# Altium project Humpback.PrjPCB (part 1 of 4)
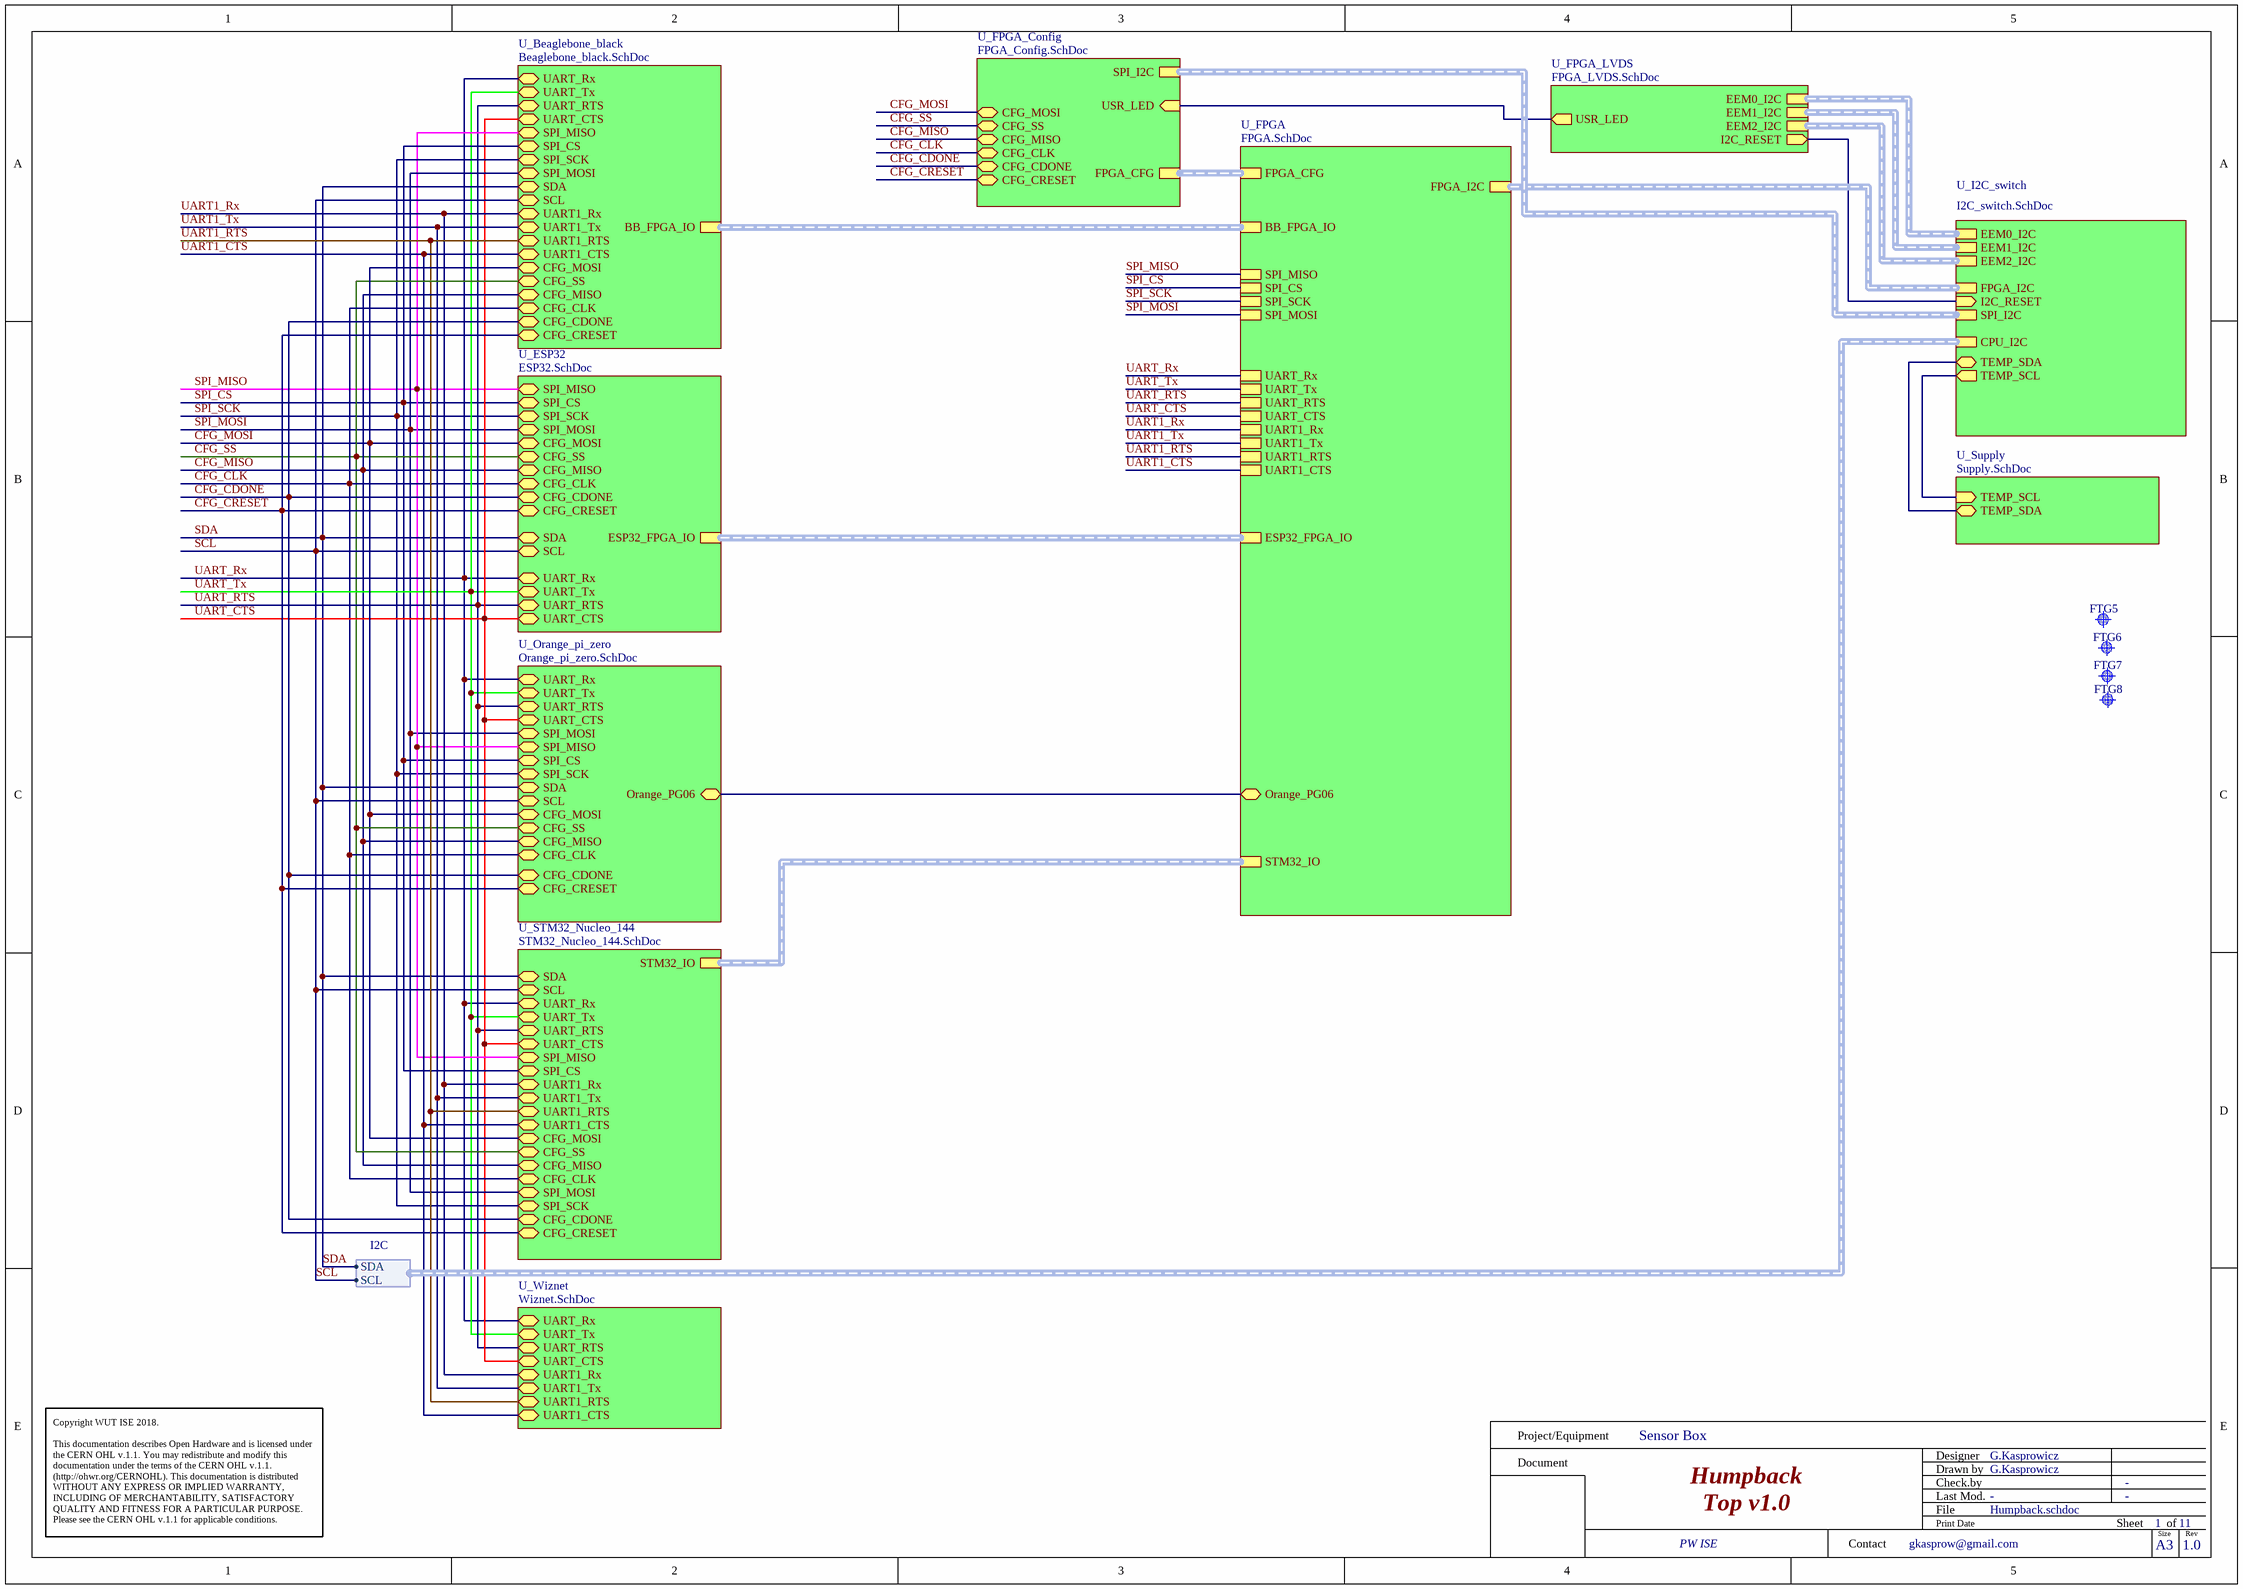
[diagram p0: Humpback.schdoc]
11 sheets, 333 parts. Net scope: hierarchical (ports join the sheet entries above them; power ports are global).
Board files: Humpback.PCBDOC, Panel_Humpback.PcbDoc
Sheets:
  Humpback.schdoc
    U_FPGA_LVDS = FPGA_LVDS.SchDoc
    U_FPGA = FPGA.SchDoc
    U_I2C_switch = I2C_switch.SchDoc
    U_Supply = Supply.SchDoc
    U_FPGA_Config = FPGA_Config.SchDoc
    U_ESP32 = ESP32.SchDoc
    U_Orange_pi_zero = Orange_pi_zero.SchDoc
    U_STM32_Nucleo_144 = STM32_Nucleo_144.SchDoc
    U_Wiznet = Wiznet.SchDoc
    U_Beaglebone_black = Beaglebone_black.SchDoc

## Sheet Humpback.schdoc: Humpback
size 420 x 297 mm; EDA_Number: ARTIQ; Projet: Humpback; Author: G.Kasprowicz; CompanyName: WUT ISE; DrawnBy: G.Kasprowicz; Organization: WUT ISE; Address1: PW ISE; Address2: Nowowiejska 15/19 00-665 Warsaw; Address3: gkasprow@gmail.com; DocumentNumber: 1; Revision: 1.0; SheetNumber: 1; SheetTotal: 11; ModifiedBy: -; CheckedDate: -; Title2: Top v1.0; DivGrp: WUT ISE; Designer: G.Kasprowicz; ModifiedDate: -; ProjectName: Sensor Box

### Parts
FTG5  Use only in PCB  [FIDUCIAL_TOP_C100-200]  (value not drawn)
FTG6  Use only in PCB  [FIDUCIAL_TOP_S100-200]  (value not drawn)
FTG7  Use only in PCB  [FIDUCIAL_TOP_S200-400]  (value not drawn)
FTG8  Use only in PCB  [FIDUCIAL_TOP_S100-200]  (value not drawn)

### Sub-sheets
U_Beaglebone_black = Beaglebone_black.SchDoc: UART_Rx (bidir), UART_Tx (bidir), UART_RTS (bidir), UART_CTS (bidir), SPI_MISO (bidir), SPI_CS (bidir), SPI_SCK (bidir), SCL (bidir), SDA (bidir), SPI_MOSI (bidir), UART1_Rx (bidir), UART1_Tx (bidir), UART1_RTS (bidir), UART1_CTS (bidir), CFG_MOSI (bidir), CFG_SS (bidir), CFG_MISO (bidir), CFG_CLK (bidir), CFG_CDONE (bidir), CFG_CRESET (bidir), BB_FPGA_IO (harness BB_FPGA_IO)
U_ESP32 = ESP32.SchDoc: SPI_MISO (bidir), SPI_CS (bidir), SPI_SCK (bidir), SPI_MOSI (bidir), CFG_MOSI (bidir), CFG_SS (bidir), CFG_MISO (bidir), CFG_CLK (bidir), UART_RTS (bidir), UART_Rx (bidir), UART_Tx (bidir), SDA (bidir), SCL (bidir), UART_CTS (bidir), CFG_CDONE (bidir), CFG_CRESET (bidir), ESP32_FPGA_IO (harness ESP32_FPGA_IO)
U_FPGA = FPGA.SchDoc: FPGA_I2C (harness I2C), FPGA_CFG (harness FPGA_CFG), BB_FPGA_IO (harness BB_FPGA_IO), SPI_MISO, SPI_CS, SPI_SCK, SPI_MOSI, UART_Rx, UART_Tx, UART_RTS, UART_CTS, UART1_Rx, UART1_Tx, UART1_RTS, UART1_CTS, ESP32_FPGA_IO (harness ESP32_FPGA_IO), Orange_PG06 (bidir), STM32_IO (harness STM32_IO)
U_FPGA_Config = FPGA_Config.SchDoc: FPGA_CFG (harness FPGA_CFG), SPI_I2C (harness I2C), USR_LED (in), CFG_CLK (bidir), CFG_MISO (bidir), CFG_SS (bidir), CFG_MOSI (bidir), CFG_CDONE (bidir), CFG_CRESET (bidir)
U_FPGA_LVDS = FPGA_LVDS.SchDoc: EEM0_I2C (harness I2C), EEM1_I2C (harness I2C), EEM2_I2C (harness I2C), USR_LED (out), I2C_RESET (out)
U_I2C_switch = I2C_switch.SchDoc: EEM0_I2C (harness I2C), EEM1_I2C (harness I2C), FPGA_I2C (harness I2C), SPI_I2C (harness I2C), I2C_RESET (in), TEMP_SCL (out), TEMP_SDA (bidir), EEM2_I2C (harness I2C), CPU_I2C (harness I2C)
U_Orange_pi_zero = Orange_pi_zero.SchDoc: UART_Rx (bidir), UART_Tx (bidir), UART_RTS (bidir), UART_CTS (bidir), SPI_MOSI (bidir), SPI_MISO (bidir), SPI_CS (bidir), SPI_SCK (bidir), SDA (bidir), SCL (bidir), CFG_MOSI (bidir), CFG_SS (bidir), CFG_MISO (bidir), CFG_CLK (bidir), CFG_CDONE (bidir), CFG_CRESET (bidir), Orange_PG06 (bidir)
U_STM32_Nucleo_144 = STM32_Nucleo_144.SchDoc: STM32_IO (harness STM32_IO), SDA (bidir), SCL (bidir), UART_Rx (bidir), UART_Tx (bidir), UART_RTS (bidir), UART_CTS (bidir), SPI_MISO (bidir), SPI_CS (bidir), UART1_Rx (bidir), UART1_Tx (bidir), UART1_RTS (bidir), UART1_CTS (bidir), CFG_MOSI (bidir), CFG_SS (bidir), CFG_MISO (bidir), CFG_CLK (bidir), SPI_MOSI (bidir), SPI_SCK (bidir), CFG_CDONE (bidir), CFG_CRESET (bidir)
U_Supply = Supply.SchDoc: TEMP_SCL (in), TEMP_SDA (bidir)
U_Wiznet = Wiznet.SchDoc: UART_Rx (bidir), UART_Tx (bidir), UART_RTS (bidir), UART_CTS (bidir), UART1_Rx (bidir), UART1_Tx (bidir), UART1_RTS (bidir), UART1_CTS (bidir)

### Harnesses
I2C: SDA, SCL

### Nets
CFG_CDONE: sheet U_FPGA_Config/CFG_CDONE, sheet U_ESP32/CFG_CDONE, sheet U_Orange_pi_zero/CFG_CDONE, sheet U_STM32_Nucleo_144/CFG_CDONE, sheet U_Beaglebone_black/CFG_CDONE
CFG_CLK: sheet U_FPGA_Config/CFG_CLK, sheet U_ESP32/CFG_CLK, sheet U_Orange_pi_zero/CFG_CLK, sheet U_STM32_Nucleo_144/CFG_CLK, sheet U_Beaglebone_black/CFG_CLK
CFG_CRESET: sheet U_FPGA_Config/CFG_CRESET, sheet U_ESP32/CFG_CRESET, sheet U_Orange_pi_zero/CFG_CRESET, sheet U_STM32_Nucleo_144/CFG_CRESET, sheet U_Beaglebone_black/CFG_CRESET
CFG_MISO: sheet U_FPGA_Config/CFG_MISO, sheet U_ESP32/CFG_MISO, sheet U_Orange_pi_zero/CFG_MISO, sheet U_STM32_Nucleo_144/CFG_MISO, sheet U_Beaglebone_black/CFG_MISO
CFG_MOSI: sheet U_FPGA_Config/CFG_MOSI, sheet U_ESP32/CFG_MOSI, sheet U_Orange_pi_zero/CFG_MOSI, sheet U_STM32_Nucleo_144/CFG_MOSI, sheet U_Beaglebone_black/CFG_MOSI
CFG_SS: sheet U_FPGA_Config/CFG_SS, sheet U_ESP32/CFG_SS, sheet U_Orange_pi_zero/CFG_SS, sheet U_STM32_Nucleo_144/CFG_SS, sheet U_Beaglebone_black/CFG_SS
I2C_RESET: sheet U_FPGA_LVDS/I2C_RESET, sheet U_I2C_switch/I2C_RESET
Orange_PG06: sheet U_FPGA/Orange_PG06, sheet U_Orange_pi_zero/Orange_PG06
SCL: sheet U_ESP32/SCL, sheet U_Orange_pi_zero/SCL, sheet U_STM32_Nucleo_144/SCL, sheet U_Beaglebone_black/SCL, sheet U_I2C_switch/CPU_I2C.SCL
SDA: sheet U_ESP32/SDA, sheet U_Orange_pi_zero/SDA, sheet U_STM32_Nucleo_144/SDA, sheet U_Beaglebone_black/SDA, sheet U_I2C_switch/CPU_I2C.SDA
SPI_CS: sheet U_FPGA/SPI_CS, sheet U_ESP32/SPI_CS, sheet U_Orange_pi_zero/SPI_CS, sheet U_STM32_Nucleo_144/SPI_CS, sheet U_Beaglebone_black/SPI_CS
SPI_MISO: sheet U_FPGA/SPI_MISO, sheet U_ESP32/SPI_MISO, sheet U_Orange_pi_zero/SPI_MISO, sheet U_STM32_Nucleo_144/SPI_MISO, sheet U_Beaglebone_black/SPI_MISO
SPI_MOSI: sheet U_FPGA/SPI_MOSI, sheet U_ESP32/SPI_MOSI, sheet U_Orange_pi_zero/SPI_MOSI, sheet U_STM32_Nucleo_144/SPI_MOSI, sheet U_Beaglebone_black/SPI_MOSI
SPI_SCK: sheet U_FPGA/SPI_SCK, sheet U_ESP32/SPI_SCK, sheet U_Orange_pi_zero/SPI_SCK, sheet U_STM32_Nucleo_144/SPI_SCK, sheet U_Beaglebone_black/SPI_SCK
TEMP_SCL: sheet U_I2C_switch/TEMP_SCL, sheet U_Supply/TEMP_SCL
TEMP_SDA: sheet U_I2C_switch/TEMP_SDA, sheet U_Supply/TEMP_SDA
UART1_CTS: sheet U_FPGA/UART1_CTS, sheet U_STM32_Nucleo_144/UART1_CTS, sheet U_Wiznet/UART1_CTS, sheet U_Beaglebone_black/UART1_CTS
UART1_RTS: sheet U_FPGA/UART1_RTS, sheet U_STM32_Nucleo_144/UART1_RTS, sheet U_Wiznet/UART1_RTS, sheet U_Beaglebone_black/UART1_RTS
UART1_Rx: sheet U_FPGA/UART1_Rx, sheet U_STM32_Nucleo_144/UART1_Rx, sheet U_Wiznet/UART1_Rx, sheet U_Beaglebone_black/UART1_Rx
UART1_Tx: sheet U_FPGA/UART1_Tx, sheet U_STM32_Nucleo_144/UART1_Tx, sheet U_Wiznet/UART1_Tx, sheet U_Beaglebone_black/UART1_Tx
UART_CTS: sheet U_FPGA/UART_CTS, sheet U_ESP32/UART_CTS, sheet U_Orange_pi_zero/UART_CTS, sheet U_STM32_Nucleo_144/UART_CTS, sheet U_Wiznet/UART_CTS, sheet U_Beaglebone_black/UART_CTS
UART_RTS: sheet U_FPGA/UART_RTS, sheet U_ESP32/UART_RTS, sheet U_Orange_pi_zero/UART_RTS, sheet U_STM32_Nucleo_144/UART_RTS, sheet U_Wiznet/UART_RTS, sheet U_Beaglebone_black/UART_RTS
UART_Rx: sheet U_FPGA/UART_Rx, sheet U_ESP32/UART_Rx, sheet U_Orange_pi_zero/UART_Rx, sheet U_STM32_Nucleo_144/UART_Rx, sheet U_Wiznet/UART_Rx, sheet U_Beaglebone_black/UART_Rx
UART_Tx: sheet U_FPGA/UART_Tx, sheet U_ESP32/UART_Tx, sheet U_Orange_pi_zero/UART_Tx, sheet U_STM32_Nucleo_144/UART_Tx, sheet U_Wiznet/UART_Tx, sheet U_Beaglebone_black/UART_Tx
USR_LED: sheet U_FPGA_LVDS/USR_LED, sheet U_FPGA_Config/USR_LED

### Buses and harness runs
harness sheet U_Beaglebone_black/BB_FPGA_IO = sheet U_FPGA/BB_FPGA_IO
harness sheet U_ESP32/ESP32_FPGA_IO = sheet U_FPGA/ESP32_FPGA_IO
harness sheet U_FPGA/FPGA_CFG = sheet U_FPGA_Config/FPGA_CFG
harness sheet U_FPGA/FPGA_I2C = sheet U_I2C_switch/FPGA_I2C
harness sheet U_FPGA/STM32_IO = sheet U_STM32_Nucleo_144/STM32_IO
harness sheet U_FPGA_Config/SPI_I2C = sheet U_I2C_switch/SPI_I2C
harness sheet U_FPGA_LVDS/EEM0_I2C = sheet U_I2C_switch/EEM0_I2C
harness sheet U_FPGA_LVDS/EEM1_I2C = sheet U_I2C_switch/EEM1_I2C
harness sheet U_FPGA_LVDS/EEM2_I2C = sheet U_I2C_switch/EEM2_I2C

### Notes on the sheet
- Project/Equipment
- Document
- Designer
- Drawn by
- Check.by
- Copyright WUT ISE 2018.
  This documentation describes Open Hardware and is licensed under the CERN OHL v.1.1. You may redistribute and modify this documentation under the terms of the CERN OHL v.1.1. (http://ohwr.org/CERNOHL). This documentation is distributed WITHOUT ANY EXPRESS OR IMPLIED WARRANTY, INCLUDING OF MERCHANTABILITY, SATISFACTORY QUALITY AND FITNESS FOR A PARTICULAR PURPOSE. Please see the CERN OHL v.1.1 for applicable conditions.
- Contact
- File
- Last Mod.
- Print Date
- Sheet
- Size
- A3
- of
- Rev

### Library data of the parts
FTG5 = FIDUCIAL_TARGET_C100-200: Fiducial Target; Part Description: Round Fiducial Target, Top Layer, 1.0mm, Top Solder 2.0mm, Keepout =2.0mm; Mounted: No; Part Number: FIDUCIAL_TARGET_C100-200; Component Kind: Standard (No BOM); Component Type: Standard (No BOM); Pin Count: 1; Family: Fiducial; Socket: No; SMD: Yes; Sense: No; Status: None; ComponentHeight: 0mm; HelpURL: Undefined; Author: CERN DEM JLC; CreateDate: 09.02.2010; LatestRevisionDate: 04.04.2012; PackageDescription: Round Fiducial Target, Top Layer, 1.0mm, Top Solder 2.0mm, Keepout =2.0mm
FTG6 FTG8 = FIDUCIAL_TARGET_S100-200: Fiducial Target; Part Description: Square Fiducial Target, Top Layer, 1.0mm, Top Solder 2.0mm, Keepout =2.0mm; Mounted: No; Part Number: FIDUCIAL_TARGET_S100-200; Component Kind: Standard (No BOM); Component Type: Standard (No BOM); Pin Count: 1; Family: Fiducial; Socket: No; SMD: Yes; Sense: No; Status: None; ComponentHeight: 0mm; HelpURL: Undefined; Author: CERN DEM JLC; CreateDate: 09.02.2010; LatestRevisionDate: 04.04.2012; PackageDescription: Square Fiducial Target, Top Layer, 1.0mm, Top Solder 2.0mm, Keepout =2.0mm
FTG7 = FIDUCIAL_TARGET_S200-400: Fiducial Target; Part Description: Square Fiducial Target, Top Layer, 2.0mm, Top Solder 4.0mm, Keepout =4.0mm; Mounted: No; Part Number: FIDUCIAL_TARGET_S200-400; Component Kind: Standard (No BOM); Component Type: Standard (No BOM); Pin Count: 1; Family: Fiducial; Socket: No; SMD: Yes; Sense: No; Status: None; ComponentHeight: 0mm; HelpURL: Undefined; Author: CERN DEM JLC; CreateDate: 02.06.2008; LatestRevisionDate: 04.04.2012; PackageDescription: Square Fiducial Target, Top Layer, 2.0mm, Top Solder 4.0mm, Keepout =4.0mm

## Sheet FPGA_LVDS.SchDoc: Humpback
size 420 x 297 mm; EDA_Number: ARTIQ; Projet: Humpback; Author: G.Kasprowicz; CompanyName: WUT ISE; DrawnBy: G.Kasprowicz; Organization: WUT ISE; Address1: PW ISE; Address2: Nowowiejska 15/19 00-665 Warsaw; Address3: gkasprow@gmail.com; DocumentNumber: 3; Revision: 1.0; SheetNumber: 3; SheetTotal: 11; ModifiedBy: -; CheckedDate: -; Title2: FPGA LVDS bank v1.0; DivGrp: WUT ISE; Designer: G.Kasprowicz; ModifiedDate: -; ProjectName: Sensor Box
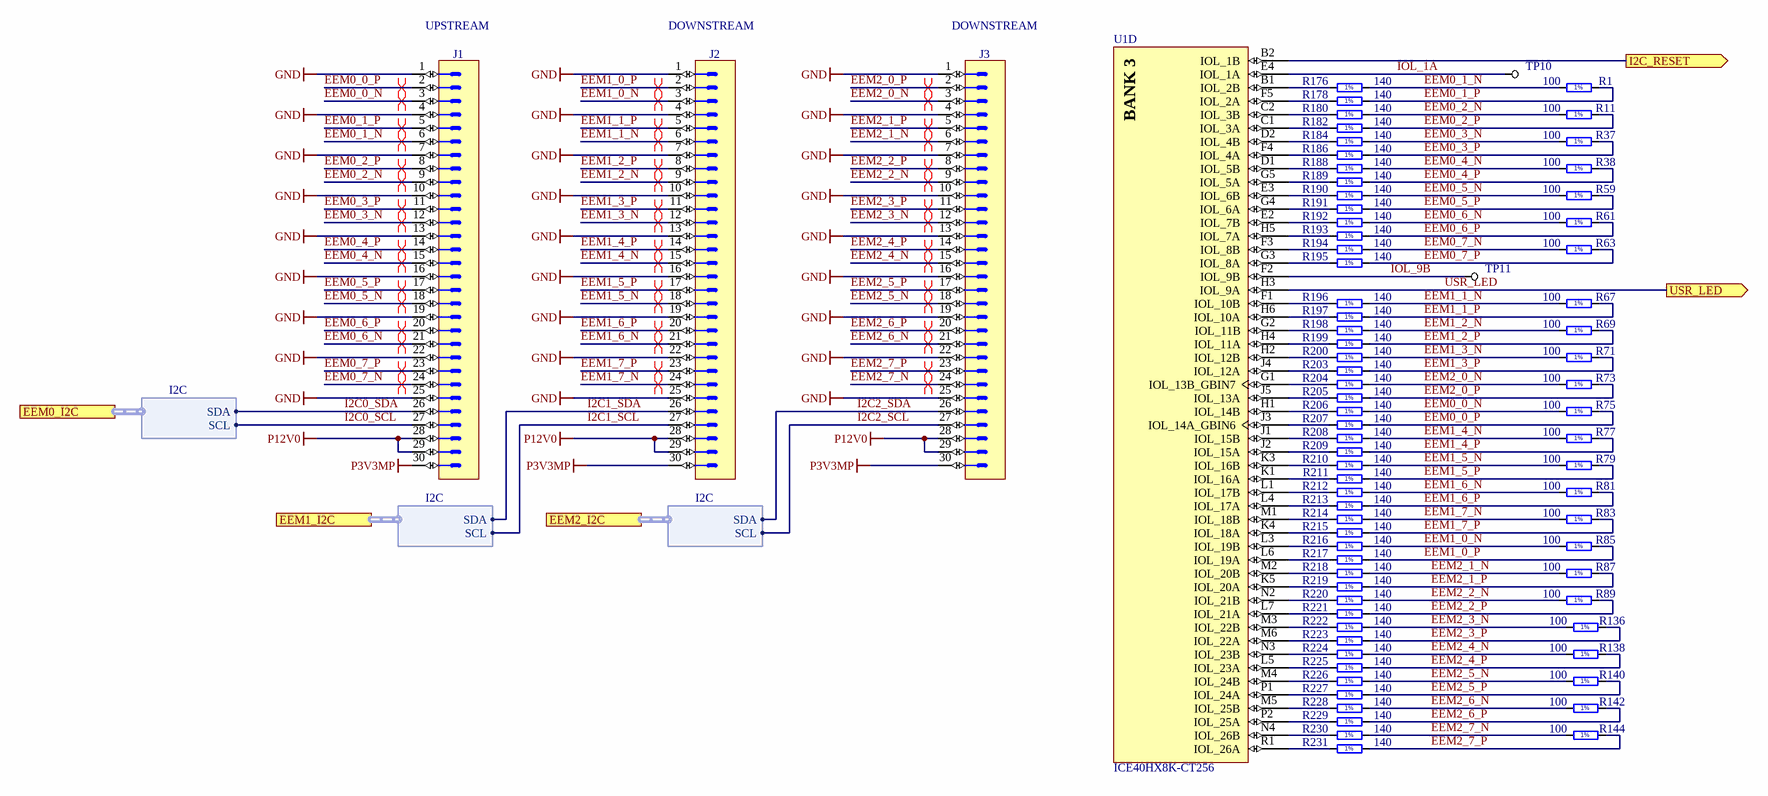
[diagram p1: FPGA_LVDS.SchDoc]

### Parts
J1  (no value)  [3M_N2530-6002RB]
J2  (no value)  [3M_N2530-6002RB]
J3  (no value)  [3M_N2530-6002RB]
R1  100  [RESC1005X40N]
R11  100  [RESC1005X40N]
R37  100  [RESC1005X40N]
R38  100  [RESC1005X40N]
R59  100  [RESC1005X40N]
R61  100  [RESC1005X40N]
R63  100  [RESC1005X40N]
R67  100  [RESC1005X40N]
R69  100  [RESC1005X40N]
R71  100  [RESC1005X40N]
R73  100  [RESC1005X40N]
R75  100  [RESC1005X40N]
R77  100  [RESC1005X40N]
R79  100  [RESC1005X40N]
R81  100  [RESC1005X40N]
R83  100  [RESC1005X40N]
R85  100  [RESC1005X40N]
R87  100  [RESC1005X40N]
R89  100  [RESC1005X40N]
R136  100  [RESC1005X40N]
R138  100  [RESC1005X40N]
R140  100  [RESC1005X40N]
R142  100  [RESC1005X40N]
R144  100  [RESC1005X40N]
R176  140  [RESC0603X28N]
R178  140  [RESC0603X28N]
R180  140  [RESC0603X28N]
R182  140  [RESC0603X28N]
R184  140  [RESC0603X28N]
R186  140  [RESC0603X28N]
R188  140  [RESC0603X28N]
R189  140  [RESC0603X28N]
R190  140  [RESC0603X28N]
R191  140  [RESC0603X28N]
R192  140  [RESC0603X28N]
R193  140  [RESC0603X28N]
R194  140  [RESC0603X28N]
R195  140  [RESC0603X28N]
R196  140  [RESC0603X28N]
R197  140  [RESC0603X28N]
R198  140  [RESC0603X28N]
R199  140  [RESC0603X28N]
R200  140  [RESC0603X28N]
R203  140  [RESC0603X28N]
R204  140  [RESC0603X28N]
R205  140  [RESC0603X28N]
R206  140  [RESC0603X28N]
R207  140  [RESC0603X28N]
R208  140  [RESC0603X28N]
R209  140  [RESC0603X28N]
R210  140  [RESC0603X28N]
R211  140  [RESC0603X28N]
R212  140  [RESC0603X28N]
R213  140  [RESC0603X28N]
R214  140  [RESC0603X28N]
R215  140  [RESC0603X28N]
R216  140  [RESC0603X28N]
R217  140  [RESC0603X28N]
R218  140  [RESC0603X28N]
R219  140  [RESC0603X28N]
R220  140  [RESC0603X28N]
R221  140  [RESC0603X28N]
R222  140  [RESC0603X28N]
R223  140  [RESC0603X28N]
R224  140  [RESC0603X28N]
R225  140  [RESC0603X28N]
R226  140  [RESC0603X28N]
R227  140  [RESC0603X28N]
R228  140  [RESC0603X28N]
R229  140  [RESC0603X28N]
R230  140  [RESC0603X28N]
R231  140  [RESC0603X28N]
TP10  TP  [TP]  (value not drawn)
TP11  TP  [TP]  (value not drawn)
U1  ICE40HX8K-CT256  [LATC-caBGA-256]  (part D of 5)

### Ports
EEM0_I2C (harness I2C), EEM1_I2C (harness I2C), EEM2_I2C (harness I2C), I2C_RESET (out), USR_LED (out)

### Harnesses
I2C: SDA, SCL

### Nets
GND: J1.1 J1.4 J1.7 J1.10 J1.13 J1.16 J1.19 J1.22 J1.25 J2.1 J2.4 J2.7 J2.10 J2.13 J2.16 J2.19 J2.22 J2.25 J3.1 J3.4 J3.7 J3.10 J3.13 J3.16 J3.19 J3.22 J3.25
P3V3MP: J1.30 J2.30 J3.30
P12V0: J1.28 J1.29 J2.28 J2.29 J3.28 J3.29
EEM0_0_N: J1.3 R75.1 R206.2
EEM0_0_P: J1.2 R75.2 R207.2
EEM0_1_N: J1.6 R1.1 R176.2
EEM0_1_P: J1.5 R1.2 R178.2
EEM0_2_N: J1.9 R11.1 R180.2
EEM0_2_P: J1.8 R11.2 R182.2
EEM0_3_N: J1.12 R37.1 R184.2
EEM0_3_P: J1.11 R37.2 R186.2
EEM0_4_N: J1.15 R38.1 R188.2
EEM0_4_P: J1.14 R38.2 R189.2
EEM0_5_N: J1.18 R59.1 R190.2
EEM0_5_P: J1.17 R59.2 R191.2
EEM0_6_N: J1.21 R61.1 R192.2
EEM0_6_P: J1.20 R61.2 R193.2
EEM0_7_N: J1.24 R63.1 R194.2
EEM0_7_P: J1.23 R63.2 R195.2
EEM1_0_N: J2.3 R85.1 R216.2
EEM1_0_P: J2.2 R85.2 R217.2
EEM1_1_N: J2.6 R67.1 R196.2
EEM1_1_P: J2.5 R67.2 R197.2
EEM1_2_N: J2.9 R69.1 R198.2
EEM1_2_P: J2.8 R69.2 R199.2
EEM1_3_N: J2.12 R71.1 R200.2
EEM1_3_P: J2.11 R71.2 R203.2
EEM1_4_N: J2.15 R77.1 R208.2
EEM1_4_P: J2.14 R77.2 R209.2
EEM1_5_N: J2.18 R79.1 R210.2
EEM1_5_P: J2.17 R79.2 R211.2
EEM1_6_N: J2.21 R81.1 R212.2
EEM1_6_P: J2.20 R81.2 R213.2
EEM1_7_N: J2.24 R83.1 R214.2
EEM1_7_P: J2.23 R83.2 R215.2
EEM2_0_N: J3.3 R73.1 R204.2
EEM2_0_P: J3.2 R73.2 R205.2
EEM2_1_N: J3.6 R87.1 R218.2
EEM2_1_P: J3.5 R87.2 R219.2
EEM2_2_N: J3.9 R89.1 R220.2
EEM2_2_P: J3.8 R89.2 R221.2
EEM2_3_N: J3.12 R136.1 R222.2
EEM2_3_P: J3.11 R136.2 R223.2
EEM2_4_N: J3.15 R138.1 R224.2
EEM2_4_P: J3.14 R138.2 R225.2
EEM2_5_N: J3.18 R140.1 R226.2
EEM2_5_P: J3.17 R140.2 R227.2
EEM2_6_N: J3.21 R142.1 R228.2
EEM2_6_P: J3.20 R142.2 R229.2
EEM2_7_N: J3.24 R144.1 R230.2
EEM2_7_P: J3.23 R144.2 R231.2
I2C0_SCL: J1.27 ; port EEM0_I2C.SCL  [project net EEM0_I2C_SCL]
I2C0_SDA: J1.26 ; port EEM0_I2C.SDA  [project net EEM0_I2C_SDA]
I2C1_SCL: J2.27 ; port EEM1_I2C.SCL  [project net EEM1_I2C_SCL]
I2C1_SDA: J2.26 ; port EEM1_I2C.SDA  [project net EEM1_I2C_SDA]
I2C2_SCL: J3.27 ; port EEM2_I2C.SCL  [project net EEM2_I2C_SCL]
I2C2_SDA: J3.26 ; port EEM2_I2C.SDA  [project net EEM2_I2C_SDA]
I2C_RESET: U1.B2(IOL_1B) ; port I2C_RESET
IOL_1A: TP10.1 U1.E4(IOL_1A)
IOL_9B: TP11.1 U1.F2(IOL_9B)
USR_LED: U1.H3(IOL_9A) ; port USR_LED
NetR176_1: R176.1 U1.B1(IOL_2B)
NetR178_1: R178.1 U1.F5(IOL_2A)
NetR180_1: R180.1 U1.C2(IOL_3B)
NetR182_1: R182.1 U1.C1(IOL_3A)
NetR184_1: R184.1 U1.D2(IOL_4B)
NetR186_1: R186.1 U1.F4(IOL_4A)
NetR188_1: R188.1 U1.D1(IOL_5B)
NetR189_1: R189.1 U1.G5(IOL_5A)
NetR190_1: R190.1 U1.E3(IOL_6B)
NetR191_1: R191.1 U1.G4(IOL_6A)
NetR192_1: R192.1 U1.E2(IOL_7B)
NetR193_1: R193.1 U1.H5(IOL_7A)
NetR194_1: R194.1 U1.F3(IOL_8B)
NetR195_1: R195.1 U1.G3(IOL_8A)
NetR196_1: R196.1 U1.F1(IOL_10B)
NetR197_1: R197.1 U1.H6(IOL_10A)
NetR198_1: R198.1 U1.G2(IOL_11B)
NetR199_1: R199.1 U1.H4(IOL_11A)
NetR200_1: R200.1 U1.H2(IOL_12B)
NetR203_1: R203.1 U1.J4(IOL_12A)
NetR204_1: R204.1 U1.G1(IOL_13B_GBIN7)
NetR205_1: R205.1 U1.J5(IOL_13A)
NetR206_1: R206.1 U1.H1(IOL_14B)
NetR207_1: R207.1 U1.J3(IOL_14A_GBIN6)
NetR208_1: R208.1 U1.J1(IOL_15B)
NetR209_1: R209.1 U1.J2(IOL_15A)
NetR210_1: R210.1 U1.K3(IOL_16B)
NetR211_1: R211.1 U1.K1(IOL_16A)
NetR212_1: R212.1 U1.L1(IOL_17B)
NetR213_1: R213.1 U1.L4(IOL_17A)
NetR214_1: R214.1 U1.M1(IOL_18B)
NetR215_1: R215.1 U1.K4(IOL_18A)
NetR216_1: R216.1 U1.L3(IOL_19B)
NetR217_1: R217.1 U1.L6(IOL_19A)
NetR218_1: R218.1 U1.M2(IOL_20B)
NetR219_1: R219.1 U1.K5(IOL_20A)
NetR220_1: R220.1 U1.N2(IOL_21B)
NetR221_1: R221.1 U1.L7(IOL_21A)
NetR222_1: R222.1 U1.M3(IOL_22B)
NetR223_1: R223.1 U1.M6(IOL_22A)
NetR224_1: R224.1 U1.N3(IOL_23B)
NetR225_1: R225.1 U1.L5(IOL_23A)
NetR226_1: R226.1 U1.M4(IOL_24B)
NetR227_1: R227.1 U1.P1(IOL_24A)
NetR228_1: R228.1 U1.M5(IOL_25B)
NetR229_1: R229.1 U1.P2(IOL_25A)
NetR230_1: R230.1 U1.N4(IOL_26B)
NetR231_1: R231.1 U1.R1(IOL_26A)

### Layout directives
differential pair: EEM0_0_N, EEM0_0_P, EEM0_1_N, EEM0_1_P, EEM0_2_N, EEM0_2_P, EEM0_3_N, EEM0_3_P, EEM0_4_N, EEM0_4_P, EEM0_5_N, EEM0_5_P, EEM0_6_N, EEM0_6_P, EEM0_7_N, EEM0_7_P, EEM1_0_N, EEM1_0_P, EEM1_1_N, EEM1_1_P, EEM1_2_N, EEM1_2_P, EEM1_3_N, EEM1_3_P, EEM1_4_N, EEM1_4_P, EEM1_5_N, EEM1_5_P, EEM1_6_N, EEM1_6_P, EEM1_7_N, EEM1_7_P, EEM2_0_N, EEM2_0_P, EEM2_1_N, EEM2_1_P, EEM2_2_N, EEM2_2_P, EEM2_3_N, EEM2_3_P, EEM2_4_N, EEM2_4_P, EEM2_5_N, EEM2_5_P, EEM2_6_N, EEM2_6_P, EEM2_7_N, EEM2_7_P

### Notes on the sheet
- (near J1) UPSTREAM
- (near J2) DOWNSTREAM
- (near J3) DOWNSTREAM
- Project/Equipment
- Document
- Designer
- Drawn by
- Check.by
- Copyright WUT ISE 2018.
  This documentation describes Open Hardware and is licensed under the CERN OHL v.1.1. You may redistribute and modify this documentation under the terms of the CERN OHL v.1.1. (http://ohwr.org/CERNOHL). This documentation is distributed WITHOUT ANY EXPRESS OR IMPLIED WARRANTY, INCLUDING OF MERCHANTABILITY, SATISFACTORY QUALITY AND FITNESS FOR A PARTICULAR PURPOSE. Please see the CERN OHL v.1.1 for applicable conditions.
- Contact
- File
- Last Mod.
- Print Date
- Sheet
- Size
- A3
- of
- Rev
- (in symbol CMP-0962-00001-1, part D) BANK 3
- (in symbol R0201_140R_1%_0.05W_200PPM) 1%
- (in symbol R0402_100R_1%_0.0625W_100PPM) 1%

### Library data of the parts
J1-J3 = 3M_N2530-6002RB: Connector 30 Male; Part Description: 30 Contacts - Straight .100'' x .100'' Low Profile Four-Wall Header, 2500 Series; Manufacturer: 3M; PressFit: No; Part Number: 3M_N2530-6002RB; Component Kind: Standard; Component Type: Standard; Pin Count: 30; Family: Header 30; Mounted: Yes; Socket: No; SMD: No; Sense: No; Status: None; Manufacturer Part Number: N2530-6002RB; ComponentHeight: 10.03mm; HelpURL: \\cern.ch\dfs\Applications\Altium\Datasheets\3M_N2530-6002RB.pdf; Author: CERN DEM JLC; CreateDate: 11.02.2009; LatestRevisionDate: 11.08.2009
R1 R11 R37 R38 R59 R61 R63 R67 R69 R71 R73 R75 R77 R79 R81 R83 R85 R87 R89 R136 R138 R140 R142 R144 = R0402_100R_1%_0.0625W_100PPM: Resistor - 1%; Part Description: General Purpose Thick Film Chip Resistor; Manufacturer: GENERIC; Manufacturer1 Part Number: 232270671001L; TC: ±100ppm/°C; PressFit: No; Part Number: R0402_100R_1%_0.0625W_100PPM; Component Kind: Standard; Component Type: Standard; Pin Count: 2; Value: 100; Status: Not Recommended; Power: 0.0625W; Tolerance: ±1%; Manufacturer Part Number: R0402_100R_1%_0.0625W_100PPM; Case: 0402; Mounted: Yes; Sense: No; Socket: No; SMD: Yes; Manufacturer1 Example: YAGEO PHYCOMP; Manufacturer1 ComponentHeight: 0.4mm; HelpURL: \\cern.ch\dfs\Applications\Altium\Datasheets\R0402_Phycomp_RC0402.pdf; Author: CERN DEM JLC; CreateDate: 03/12/2007; LatestRevisionDate: 17/10/2012
R176 R178 R180 R182 R184 R186 R188-R200 R203-R231 = R0201_140R_1%_0.05W_200PPM: Resistor - 1%; Part Description: Thick Film Chip Resistor; Manufacturer: GENERIC; Manufacturer1 Part Number: CRCW0201140RFNED; Power: 0.05W; TC: ±200ppm/°C; PressFit: No; Part Number: R0201_140R_1%_0.05W_200PPM; Component Kind: Standard; Component Type: Standard; Pin Count: 2; Value: 140; Status: Not Recommended; Tolerance: ±1%; Manufacturer Part Number: R0201_140R_1%_0.05W_200PPM; Case: 0201; Mounted: Yes; Sense: No; Socket: No; SMD: Yes; Manufacturer1 Example: VISHAY; Manufacturer1 ComponentHeight: 0.27mm; HelpURL: \\cern.ch\dfs\Applications\Altium\Datasheets\R0201_VISHAY_CRCW e3.pdf; Author: CERN DEM MR; CreateDate: 26/01/2016; LatestRevisionDate: 26/01/2016
TP10 TP11 = TP: Testpoint
U1 = CMP-0962-00001-1: iCE40 HX8K Series FPGA Family, 7680 Logic Cells, 1.2 V Core, 128 K Embedded RAM Bits, 256-ball caBGA, Pb-Free, Tray; Manufacturer: Lattice Semiconductor; Supply Voltage: 1.2V; Phase-Locked Loops: 2; Logic Cells: 7680; Embedded RAM Bits: 128K; PackageReference: caBGA-256; PackageDescription: 256-Ball Chip Array Ball Grid Array, Body 14 x 14 mm, Pitch 0.8 mm; RoHS: TRUE; Packing: Tray; Mounting Technology: Surface Mount; ComponentLink3URL: http://www.latticesemi.com/lit/docs/package/pkg.pdf; ComponentLink1Description: Manufacturer URL; ComponentLink3Description: Package Specification; Code_JEDEC: MO-275; PackageVersion: Rev. 03.9, 02/2013; ComponentLink1URL: http://www.latticesemi.com/en; ComponentLink2URL: http://www.latticesemi.com/~/media/Documents/DataSheets/iCE/iCE40LPHXFamilyDataSheet.pdf; PartNumber: ICE40HX8K-CT256; ComponentLink2Description: Datasheet; DatasheetVersion: Rev. 02.9

## Sheet FPGA.SchDoc: Humpback
size 420 x 297 mm; EDA_Number: ARTIQ; Projet: Humpback; Author: G.Kasprowicz; CompanyName: WUT ISE; DrawnBy: G.Kasprowicz; Organization: WUT ISE; Address1: PW ISE; Address2: Nowowiejska 15/19 00-665 Warsaw; Address3: gkasprow@gmail.com; DocumentNumber: 2; Revision: 1.0; SheetNumber: 2; SheetTotal: 11; ModifiedBy: -; CheckedDate: -; Title2: FPGA v1.0; DivGrp: WUT ISE; Designer: G.Kasprowicz; ModifiedDate: -; ProjectName: Sensor Box
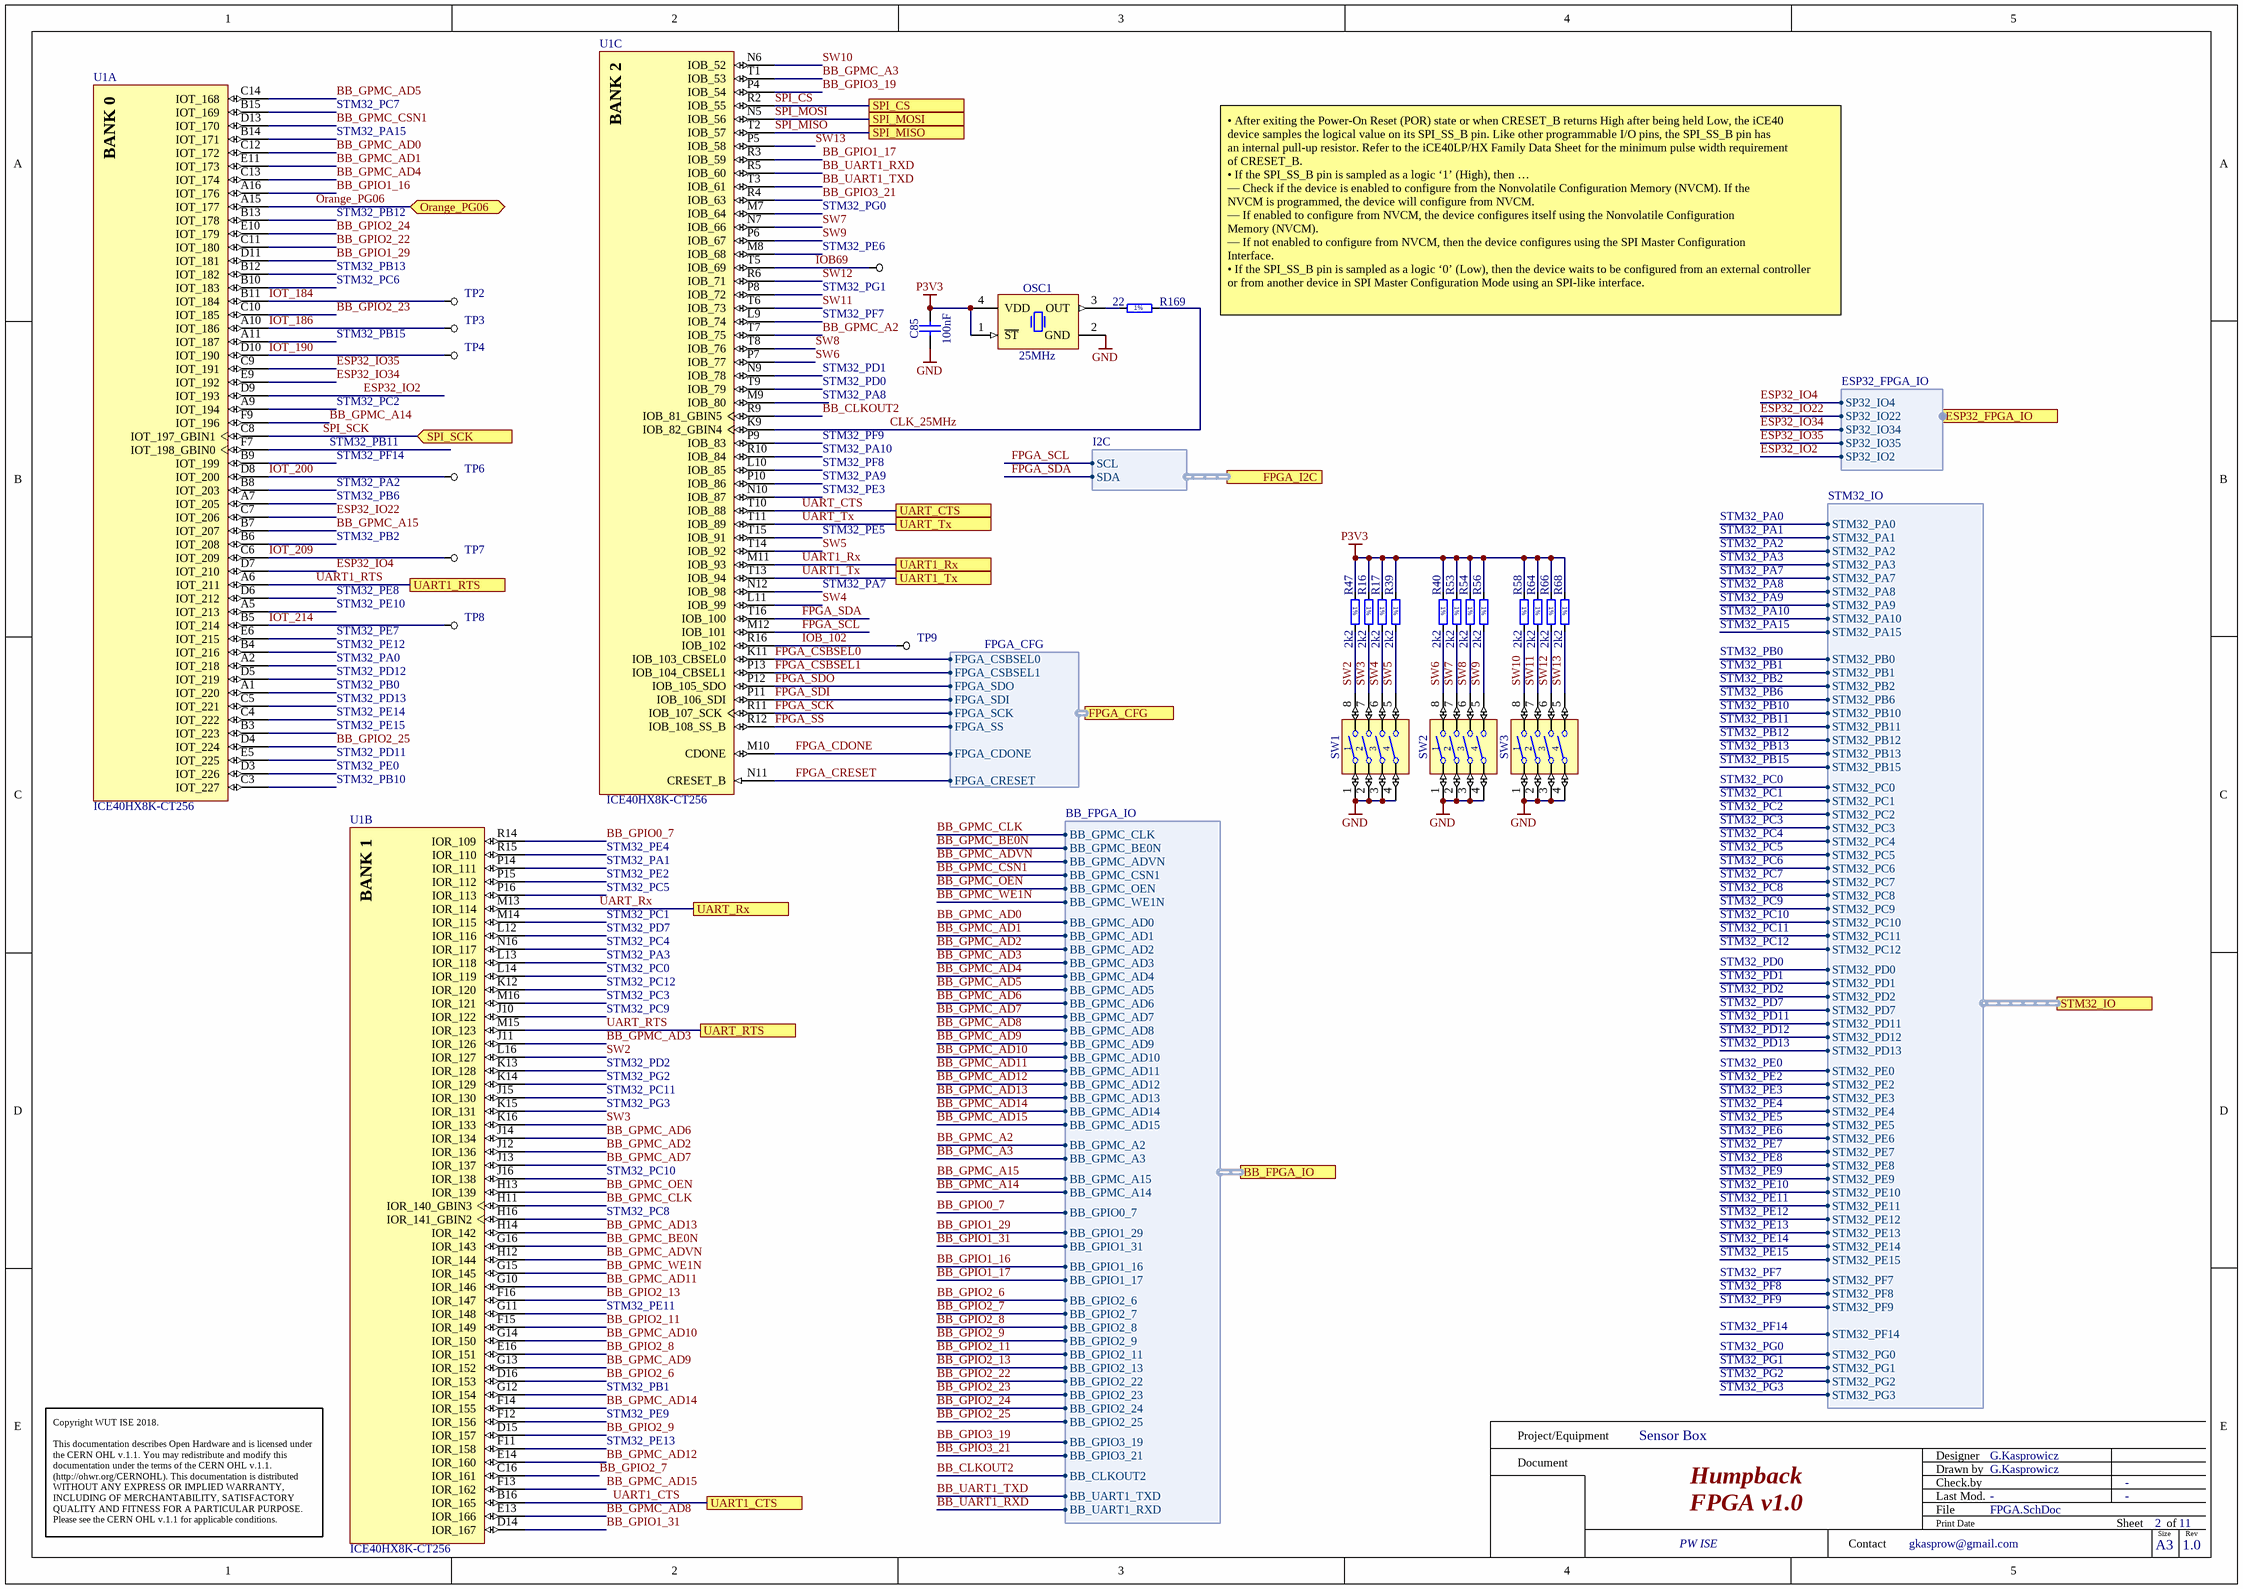
[diagram p2: FPGA.SchDoc]

### Parts
?  TP  [TP]  (value not drawn)
C85  100nF  [CAPC1005X55N]
OSC1  25MHz  [OSC_MICROCHIP_CDFN2520-4LD-PL-1]
R16  2k2  [RESC1005X40N]
R17  2k2  [RESC1005X40N]
R39  2k2  [RESC1005X40N]
R40  2k2  [RESC1005X40N]
R47  2k2  [RESC1005X40N]
R53  2k2  [RESC1005X40N]
R54  2k2  [RESC1005X40N]
R56  2k2  [RESC1005X40N]
R58  2k2  [RESC1005X40N]
R64  2k2  [RESC1005X40N]
R66  2k2  [RESC1005X40N]
R68  2k2  [RESC1005X40N]
R169  22  [RESC1005X40N]
SW1  Switch  [SW_TYCO_1571983-4]  (value not drawn)
SW2  Switch  [SW_TYCO_1571983-4]  (value not drawn)
SW3  Switch  [SW_TYCO_1571983-4]  (value not drawn)
TP2  TP  [TP]  (value not drawn)
TP3  TP  [TP]  (value not drawn)
TP4  TP  [TP]  (value not drawn)
TP6  TP  [TP]  (value not drawn)
TP7  TP  [TP]  (value not drawn)
TP8  TP  [TP]  (value not drawn)
TP9  TP  [TP]  (value not drawn)
U1  ICE40HX8K-CT256  [LATC-caBGA-256]  (parts A,B,C of 5)

### Ports
BB_FPGA_IO (harness BB_FPGA_IO), ESP32_FPGA_IO (harness ESP32_FPGA_IO), FPGA_CFG (harness FPGA_CFG), FPGA_I2C (harness I2C), Orange_PG06 (bidir), SPI_CS, SPI_MISO, SPI_MOSI, SPI_SCK (in), STM32_IO (harness STM32_IO), UART1_CTS, UART1_RTS, UART1_Rx, UART1_Tx, UART_CTS, UART_RTS, UART_Rx, UART_Tx

### Harnesses
I2C: SDA, SCL
FPGA_CFG: FPGA_CSBSEL0, FPGA_CSBSEL1, FPGA_SDO, FPGA_SDI, FPGA_SCK, FPGA_SS, FPGA_CDONE, FPGA_CRESET
STM32_IO: STM32_PA0, STM32_PA1, STM32_PA2, STM32_PA3, STM32_PA7, STM32_PA8, STM32_PA9, STM32_PA10, STM32_PA15, STM32_PB0, STM32_PB1, STM32_PB2, STM32_PB6, STM32_PB10, STM32_PB11, STM32_PB12, STM32_PB13, STM32_PB15, STM32_PC0, STM32_PC1, STM32_PC2, STM32_PC3, STM32_PC4, STM32_PC5, STM32_PC6, STM32_PC7, STM32_PC8, STM32_PC9, STM32_PC10, STM32_PC11, STM32_PC12, STM32_PD0, STM32_PD1, STM32_PD2, STM32_PD7, STM32_PD11, STM32_PD12, STM32_PD13, STM32_PE0, STM32_PE2, STM32_PE3, STM32_PE4, STM32_PE5, STM32_PE6, STM32_PE7, STM32_PE8, STM32_PE9, STM32_PE10, STM32_PE11, STM32_PE12, STM32_PE13, STM32_PE14, STM32_PE15, STM32_PF7, STM32_PF8, STM32_PF9, STM32_PF14, STM32_PG0, STM32_PG1, STM32_PG2, STM32_PG3
BB_FPGA_IO: BB_GPMC_CLK, BB_GPMC_BE0N, BB_GPMC_CSN1, BB_GPMC_OEN, BB_GPMC_AD0, BB_GPMC_AD1, BB_GPMC_AD2, BB_GPMC_AD3, BB_GPMC_AD4, BB_GPMC_AD5, BB_GPMC_AD6, BB_GPMC_AD7, BB_GPMC_AD8, BB_GPMC_AD9, BB_GPMC_AD10, BB_GPMC_AD11, BB_GPMC_AD12, BB_GPMC_AD13, BB_GPMC_AD14, BB_GPMC_AD15, BB_GPMC_A2, BB_GPMC_A3, BB_GPMC_A15, BB_GPMC_A14, BB_GPIO0_7, BB_GPIO1_29, BB_GPIO1_31, BB_GPIO1_16, BB_GPIO1_17, BB_GPIO2_6, BB_GPIO2_7, BB_GPIO2_8, BB_GPIO2_9, BB_GPIO2_11, BB_GPIO2_13, BB_GPIO2_22, BB_GPIO2_23, BB_GPIO2_24, BB_GPIO2_25, BB_GPIO3_19, BB_GPIO3_21, BB_CLKOUT2, BB_UART1_TXD, BB_UART1_RXD, BB_GPMC_ADVN, BB_GPMC_WE1N
ESP32_FPGA_IO: SP32_IO4, SP32_IO22, SP32_IO34, SP32_IO35, SP32_IO2

### Nets
GND: C85.1 OSC1.2(GND) SW1.1 SW1.2 SW1.3 SW1.4 SW2.1 SW2.2 SW2.3 SW2.4 SW3.1 SW3.2 SW3.3 SW3.4
P3V3: C85.2 OSC1.1(~{ST}) OSC1.4(VDD) R16.1 R17.1 R39.1 R40.1 R47.1 R53.1 R54.1 R56.1 R58.1 R64.1 R66.1 R68.1
BB_CLKOUT2: U1.R9(IOB_81_GBIN5) ; port BB_FPGA_IO.BB_CLKOUT2
BB_GPIO0_7: U1.R14(IOR_109) ; port BB_FPGA_IO.BB_GPIO0_7
BB_GPIO1_16: U1.A16(IOT_176) ; port BB_FPGA_IO.BB_GPIO1_16
BB_GPIO1_17: U1.R3(IOB_59) ; port BB_FPGA_IO.BB_GPIO1_17
BB_GPIO1_29: U1.D11(IOT_181) ; port BB_FPGA_IO.BB_GPIO1_29
BB_GPIO1_31: U1.D14(IOR_167) ; port BB_FPGA_IO.BB_GPIO1_31
BB_GPIO2_6: U1.D16(IOR_153) ; port BB_FPGA_IO.BB_GPIO2_6
BB_GPIO2_7: U1.C16(IOR_161) ; port BB_FPGA_IO.BB_GPIO2_7
BB_GPIO2_8: U1.E16(IOR_151) ; port BB_FPGA_IO.BB_GPIO2_8
BB_GPIO2_9: U1.D15(IOR_157) ; port BB_FPGA_IO.BB_GPIO2_9
BB_GPIO2_11: U1.F15(IOR_149) ; port BB_FPGA_IO.BB_GPIO2_11
BB_GPIO2_13: U1.F16(IOR_147) ; port BB_FPGA_IO.BB_GPIO2_13
BB_GPIO2_22: U1.C11(IOT_180) ; port BB_FPGA_IO.BB_GPIO2_22
BB_GPIO2_23: U1.C10(IOT_185) ; port BB_FPGA_IO.BB_GPIO2_23
BB_GPIO2_24: U1.E10(IOT_179) ; port BB_FPGA_IO.BB_GPIO2_24
BB_GPIO2_25: U1.D4(IOT_224) ; port BB_FPGA_IO.BB_GPIO2_25
BB_GPIO3_19: U1.P4(IOB_54) ; port BB_FPGA_IO.BB_GPIO3_19
BB_GPIO3_21: U1.R4(IOB_63) ; port BB_FPGA_IO.BB_GPIO3_21
BB_GPMC_A2: U1.T7(IOB_75) ; port BB_FPGA_IO.BB_GPMC_A2
BB_GPMC_A3: U1.T1(IOB_53) ; port BB_FPGA_IO.BB_GPMC_A3
BB_GPMC_A14: U1.F9(IOT_196) ; port BB_FPGA_IO.BB_GPMC_A14
BB_GPMC_A15: U1.B7(IOT_207) ; port BB_FPGA_IO.BB_GPMC_A15
BB_GPMC_AD0: U1.C12(IOT_172) ; port BB_FPGA_IO.BB_GPMC_AD0
BB_GPMC_AD1: U1.E11(IOT_173) ; port BB_FPGA_IO.BB_GPMC_AD1
BB_GPMC_AD2: U1.J12(IOR_136) ; port BB_FPGA_IO.BB_GPMC_AD2
BB_GPMC_AD3: U1.J11(IOR_126) ; port BB_FPGA_IO.BB_GPMC_AD3
BB_GPMC_AD4: U1.C13(IOT_174) ; port BB_FPGA_IO.BB_GPMC_AD4
BB_GPMC_AD5: U1.C14(IOT_168) ; port BB_FPGA_IO.BB_GPMC_AD5
BB_GPMC_AD6: U1.J14(IOR_134) ; port BB_FPGA_IO.BB_GPMC_AD6
BB_GPMC_AD7: U1.J13(IOR_137) ; port BB_FPGA_IO.BB_GPMC_AD7
BB_GPMC_AD8: U1.E13(IOR_166) ; port BB_FPGA_IO.BB_GPMC_AD8
BB_GPMC_AD9: U1.G13(IOR_152) ; port BB_FPGA_IO.BB_GPMC_AD9
BB_GPMC_AD10: U1.G14(IOR_150) ; port BB_FPGA_IO.BB_GPMC_AD10
BB_GPMC_AD11: U1.G10(IOR_146) ; port BB_FPGA_IO.BB_GPMC_AD11
BB_GPMC_AD12: U1.E14(IOR_160) ; port BB_FPGA_IO.BB_GPMC_AD12
BB_GPMC_AD13: U1.H14(IOR_142) ; port BB_FPGA_IO.BB_GPMC_AD13
BB_GPMC_AD14: U1.F14(IOR_155) ; port BB_FPGA_IO.BB_GPMC_AD14
BB_GPMC_AD15: U1.F13(IOR_162) ; port BB_FPGA_IO.BB_GPMC_AD15
BB_GPMC_ADVN: U1.H12(IOR_144) ; port BB_FPGA_IO.BB_GPMC_ADVN
BB_GPMC_BE0N: U1.G16(IOR_143) ; port BB_FPGA_IO.BB_GPMC_BE0N
BB_GPMC_CLK: U1.H11(IOR_140_GBIN3) ; port BB_FPGA_IO.BB_GPMC_CLK
BB_GPMC_CSN1: U1.D13(IOT_170) ; port BB_FPGA_IO.BB_GPMC_CSN1
BB_GPMC_OEN: U1.H13(IOR_139) ; port BB_FPGA_IO.BB_GPMC_OEN
BB_GPMC_WE1N: U1.G15(IOR_145) ; port BB_FPGA_IO.BB_GPMC_WE1N
BB_UART1_RXD: U1.R5(IOB_60) ; port BB_FPGA_IO.BB_UART1_RXD
BB_UART1_TXD: U1.T3(IOB_61) ; port BB_FPGA_IO.BB_UART1_TXD
CLK_25MHz: R169.2 U1.K9(IOB_82_GBIN4)
ESP32_IO2: U1.D9(IOT_193) ; port ESP32_FPGA_IO.SP32_IO2
ESP32_IO4: U1.D7(IOT_210) ; port ESP32_FPGA_IO.SP32_IO4
ESP32_IO22: U1.C7(IOT_206) ; port ESP32_FPGA_IO.SP32_IO22
ESP32_IO34: U1.E9(IOT_192) ; port ESP32_FPGA_IO.SP32_IO34
ESP32_IO35: U1.C9(IOT_191) ; port ESP32_FPGA_IO.SP32_IO35
FPGA_CDONE: U1.M10(CDONE) ; port FPGA_CFG.FPGA_CDONE
FPGA_CRESET: U1.N11(CRESET_B) ; port FPGA_CFG.FPGA_CRESET
FPGA_CSBSEL0: U1.K11(IOB_103_CBSEL0) ; port FPGA_CFG.FPGA_CSBSEL0
FPGA_CSBSEL1: U1.P13(IOB_104_CBSEL1) ; port FPGA_CFG.FPGA_CSBSEL1
FPGA_SCK: U1.R11(IOB_107_SCK) ; port FPGA_CFG.FPGA_SCK
FPGA_SCL: U1.M12(IOB_101) ; port FPGA_I2C.SCL
FPGA_SDA: U1.T16(IOB_100) ; port FPGA_I2C.SDA
FPGA_SDI: U1.P11(IOB_106_SDI) ; port FPGA_CFG.FPGA_SDI
FPGA_SDO: U1.P12(IOB_105_SDO) ; port FPGA_CFG.FPGA_SDO
FPGA_SS: U1.R12(IOB_108_SS_B) ; port FPGA_CFG.FPGA_SS
IOB69: ?.1 U1.T5(IOB_69)
IOB_102: TP9.1 U1.R16(IOB_102)
IOT_184: TP2.1 U1.B11(IOT_184)
IOT_186: TP3.1 U1.A10(IOT_186)
IOT_190: TP4.1 U1.D10(IOT_190)
IOT_200: TP6.1 U1.D8(IOT_200)
IOT_209: TP7.1 U1.C6(IOT_209)
IOT_214: TP8.1 U1.B5(IOT_214)
Orange_PG06: U1.A15(IOT_177) ; port Orange_PG06
SPI_CS: U1.R2(IOB_55) ; port SPI_CS
SPI_MISO: U1.T2(IOB_57) ; port SPI_MISO
SPI_MOSI: U1.N5(IOB_56) ; port SPI_MOSI
SPI_SCK: U1.C8(IOT_197_GBIN1) ; port SPI_SCK
STM32_PA0: U1.A2(IOT_218) ; port STM32_IO.STM32_PA0
STM32_PA1: U1.P14(IOR_111) ; port STM32_IO.STM32_PA1
STM32_PA2: U1.B8(IOT_203) ; port STM32_IO.STM32_PA2
STM32_PA3: U1.L13(IOR_118) ; port STM32_IO.STM32_PA3
STM32_PA7: U1.N12(IOB_98) ; port STM32_IO.STM32_PA7
STM32_PA8: U1.M9(IOB_80) ; port STM32_IO.STM32_PA8
STM32_PA9: U1.P10(IOB_86) ; port STM32_IO.STM32_PA9
STM32_PA10: U1.R10(IOB_84) ; port STM32_IO.STM32_PA10
STM32_PA15: U1.B14(IOT_171) ; port STM32_IO.STM32_PA15
STM32_PB0: U1.A1(IOT_220) ; port STM32_IO.STM32_PB0
STM32_PB1: U1.G12(IOR_154) ; port STM32_IO.STM32_PB1
STM32_PB2: U1.B6(IOT_208) ; port STM32_IO.STM32_PB2
STM32_PB6: U1.A7(IOT_205) ; port STM32_IO.STM32_PB6
STM32_PB10: U1.C3(IOT_227) ; port STM32_IO.STM32_PB10
STM32_PB11: U1.F7(IOT_198_GBIN0) ; port STM32_IO.STM32_PB11
STM32_PB12: U1.B13(IOT_178) ; port STM32_IO.STM32_PB12
STM32_PB13: U1.B12(IOT_182) ; port STM32_IO.STM32_PB13
STM32_PB15: U1.A11(IOT_187) ; port STM32_IO.STM32_PB15
STM32_PC0: U1.L14(IOR_119) ; port STM32_IO.STM32_PC0
STM32_PC1: U1.M14(IOR_115) ; port STM32_IO.STM32_PC1
STM32_PC2: U1.A9(IOT_194) ; port STM32_IO.STM32_PC2
STM32_PC3: U1.M16(IOR_121) ; port STM32_IO.STM32_PC3
STM32_PC4: U1.N16(IOR_117) ; port STM32_IO.STM32_PC4
STM32_PC5: U1.P16(IOR_113) ; port STM32_IO.STM32_PC5
STM32_PC6: U1.B10(IOT_183) ; port STM32_IO.STM32_PC6
STM32_PC7: U1.B15(IOT_169) ; port STM32_IO.STM32_PC7
STM32_PC8: U1.H16(IOR_141_GBIN2) ; port STM32_IO.STM32_PC8
STM32_PC9: U1.J10(IOR_122) ; port STM32_IO.STM32_PC9
STM32_PC10: U1.J16(IOR_138) ; port STM32_IO.STM32_PC10
STM32_PC11: U1.J15(IOR_130) ; port STM32_IO.STM32_PC11
STM32_PC12: U1.K12(IOR_120) ; port STM32_IO.STM32_PC12
STM32_PD0: U1.T9(IOB_79) ; port STM32_IO.STM32_PD0
STM32_PD1: U1.N9(IOB_78) ; port STM32_IO.STM32_PD1
STM32_PD2: U1.K13(IOR_128) ; port STM32_IO.STM32_PD2
STM32_PD7: U1.L12(IOR_116) ; port STM32_IO.STM32_PD7
STM32_PD11: U1.E5(IOT_225) ; port STM32_IO.STM32_PD11
STM32_PD12: U1.D5(IOT_219) ; port STM32_IO.STM32_PD12
STM32_PD13: U1.C5(IOT_221) ; port STM32_IO.STM32_PD13
STM32_PE0: U1.D3(IOT_226) ; port STM32_IO.STM32_PE0
STM32_PE2: U1.P15(IOR_112) ; port STM32_IO.STM32_PE2
STM32_PE3: U1.N10(IOB_87) ; port STM32_IO.STM32_PE3
STM32_PE4: U1.R15(IOR_110) ; port STM32_IO.STM32_PE4
STM32_PE5: U1.T15(IOB_91) ; port STM32_IO.STM32_PE5
STM32_PE6: U1.M8(IOB_68) ; port STM32_IO.STM32_PE6
STM32_PE7: U1.E6(IOT_215) ; port STM32_IO.STM32_PE7
STM32_PE8: U1.D6(IOT_212) ; port STM32_IO.STM32_PE8
STM32_PE9: U1.F12(IOR_156) ; port STM32_IO.STM32_PE9
STM32_PE10: U1.A5(IOT_213) ; port STM32_IO.STM32_PE10
STM32_PE11: U1.G11(IOR_148) ; port STM32_IO.STM32_PE11
STM32_PE12: U1.B4(IOT_216) ; port STM32_IO.STM32_PE12
STM32_PE13: U1.F11(IOR_158) ; port STM32_IO.STM32_PE13
STM32_PE14: U1.C4(IOT_222) ; port STM32_IO.STM32_PE14
STM32_PE15: U1.B3(IOT_223) ; port STM32_IO.STM32_PE15
STM32_PF7: U1.L9(IOB_74) ; port STM32_IO.STM32_PF7
STM32_PF8: U1.L10(IOB_85) ; port STM32_IO.STM32_PF8
STM32_PF9: U1.P9(IOB_83) ; port STM32_IO.STM32_PF9
STM32_PF14: U1.B9(IOT_199) ; port STM32_IO.STM32_PF14
STM32_PG0: U1.M7(IOB_64) ; port STM32_IO.STM32_PG0
STM32_PG1: U1.P8(IOB_72) ; port STM32_IO.STM32_PG1
STM32_PG2: U1.K14(IOR_129) ; port STM32_IO.STM32_PG2
STM32_PG3: U1.K15(IOR_131) ; port STM32_IO.STM32_PG3
SW2: R47.2 SW1.8 U1.L16(IOR_127)
SW3: R16.2 SW1.7 U1.K16(IOR_133)
SW4: R17.2 SW1.6 U1.L11(IOB_99)
SW5: R39.2 SW1.5 U1.T14(IOB_92)
SW6: R40.2 SW2.8 U1.P7(IOB_77)
SW7: R53.2 SW2.7 U1.N7(IOB_66)
SW8: R54.2 SW2.6 U1.T8(IOB_76)
SW9: R56.2 SW2.5 U1.P6(IOB_67)
SW10: R58.2 SW3.8 U1.N6(IOB_52)
SW11: R64.2 SW3.7 U1.T6(IOB_73)
SW12: R66.2 SW3.6 U1.R6(IOB_71)
SW13: R68.2 SW3.5 U1.P5(IOB_58)
UART1_CTS: U1.B16(IOR_165) ; port UART1_CTS
UART1_RTS: U1.A6(IOT_211) ; port UART1_RTS
UART1_Rx: U1.M11(IOB_93) ; port UART1_Rx
UART1_Tx: U1.T13(IOB_94) ; port UART1_Tx
UART_CTS: U1.T10(IOB_88) ; port UART_CTS
UART_RTS: U1.M15(IOR_123) ; port UART_RTS
UART_Rx: U1.M13(IOR_114) ; port UART_Rx
UART_Tx: U1.T11(IOB_89) ; port UART_Tx
NetOSC1_3: OSC1.3(OUT) R169.1

### Notes on the sheet
- • After exiting the Power-On Reset (POR) state or when CRESET_B returns High after being held Low, the iCE40
  device samples the logical value on its SPI_SS_B pin. Like other programmable I/O pins, the SPI_SS_B pin has
  an internal pull-up resistor. Refer to the iCE40LP/HX Family Data Sheet for the minimum pulse width requirement
  of CRESET_B.
  • If the SPI_SS_B pin is sampled as a logic ‘1’ (High), then …
  — Check if the device is enabled to configure from the Nonvolatile Configuration Memory (NVCM). If the
  NVCM is programmed, the device will configure from NVCM.
  — If enabled to configure from NVCM, the device configures itself using the Nonvolatile Configuration
  Memory (NVCM).
  — If not enabled to configure from NVCM, then the device configures using the SPI Master Configuration
  Interface.
  • If the SPI_SS_B pin is sampled as a logic ‘0’ (Low), then the device waits to be configured from an external controller
  or from another device in SPI Master Configuration Mode using an SPI-like interface.
- Project/Equipment
- Document
- Designer
- Drawn by
- Check.by
- Copyright WUT ISE 2018.
  This documentation describes Open Hardware and is licensed under the CERN OHL v.1.1. You may redistribute and modify this documentation under the terms of the CERN OHL v.1.1. (http://ohwr.org/CERNOHL). This documentation is distributed WITHOUT ANY EXPRESS OR IMPLIED WARRANTY, INCLUDING OF MERCHANTABILITY, SATISFACTORY QUALITY AND FITNESS FOR A PARTICULAR PURPOSE. Please see the CERN OHL v.1.1 for applicable conditions.
- Contact
- File
- Last Mod.
- Print Date
- Sheet
- Size
- A3
- of
- Rev
- (in symbol CMP-0962-00001-1, part A) BANK 0
- (in symbol CMP-0962-00001-1, part B) BANK 1
- (in symbol CMP-0962-00001-1, part C) BANK 2
- (in symbol R0402_2K2_1%_0.0625W_100PPM) 1%
- (in symbol R0402_22R_1%_0.0625W_100PPM) 1%

### Library data of the parts
? TP2-TP4 TP6-TP9 = TP: Testpoint
C85 = CC0402_100NF_16V_10%_X5R: Non-polarised capacitor; Part Description: SMD Multilayer Chip Ceramic Capacitor; Manufacturer: GENERIC; Manufacturer1 Part Number: GRM155R61C104KA88D; Voltage: 16V; TC: X5R; Tolerance: ±10%; Part Number: CC0402_100NF_16V_10%_X5R; Component Kind: Standard; Component Type: Standard; Pin Count: 2; Value: 100nF; Status: None; Manufacturer Part Number: CC0402_100NF_16V_10%_X5R; Case: 0402; Mounted: Yes; Socket: No; SMD: Yes; Sense: No; Manufacturer1 Example: MURATA; Manufacturer1 ComponentHeight: 0.55mm; HelpURL: \\cern.ch\dfs\Applications\Altium\Datasheets\CC0402_X5R_MURATA_GRM.pdf; Author: CERN DEM JLC; CreateDate: 10.12.2013; LatestRevisionDate: 10.12.2013
OSC1 = OSC_25MHZ_MICROCHIP_DSC1003DL5-025.0000: Oscillator 4 pins 1=S\T\ 2=GND 3=OUT 4=VDD; Part Description: 1.8V-3.3V, ±10ppm, 25pF,-40..105°C, Surface Mount Low-Power Precision CMOS Oscillator (DSC1001 Series); Manufacturer: MICROCHIP TECHNOLOGY; PressFit: No; Bonding: No; Part Number: OSC_25MHZ_MICROCHIP_DSC1003DL5-025.0000; Component Kind: Standard; Component Type: Standard; PackageDescription: MICROCHIP Case CDFN2520-4LD-PL-1, SMD Oscillator, DFN, 4 pins, 2.5mm x 2.0mm; Value: 25MHz; Manufacturer Part Number: DSC1003DL5-025.0000; Pin Count: 4; Mounted: Yes; Socket: No; SMD: Yes; Sense: No; ComponentHeight: 0.9mm; HelpURL: \\cern.ch\dfs\Applications\Altium\Datasheets\OSC_MICROCHIP_DSC1003.pdf; Author: CERN DEM JLC; CreateDate: 16/08/2018; LatestRevisionDate: 16/08/2018
R16 R17 R39 R40 R47 R53 R54 R56 R58 R64 R66 R68 = R0402_2K2_1%_0.0625W_100PPM: Resistor - 1%; Part Description: General Purpose Thick Film Chip Resistor; Manufacturer: GENERIC; Manufacturer1 Part Number: 232270672202L; TC: ±100ppm/°C; Table: Resistors SMD; Part Number: R0402_2K2_1%_0.0625W_100PPM; Component Kind: Standard; Component Type: Standard; Pin Count: 2; Value: 2k2; Status: Not recommended; Power: 0.0625W; Tolerance: ±1%; Manufacturer Part Number: R0402_2K2_1%_0.0625W_100PPM; Case: 0402; Mounted: Yes; Socket: No; SMD: Yes; Manufacturer1 Example: YAGEO PHYCOMP; Manufacturer1 ComponentHeight: 0.4mm; HelpURL: \\cern.ch\dfs\Applications\Altium\Datasheets\R0402_Phycomp_RC0402.pdf; Author: CERN DEM JLC; CreateDate: 2007-12-03; LatestRevisionDate: 2012-10-17
R169 = R0402_22R_1%_0.0625W_100PPM: Resistor - 1%; Part Description: General Purpose Thick Film Chip Resistor; Manufacturer: GENERIC; Manufacturer1 Part Number: 232270672209L; TC: ±100ppm/°C; PressFit: No; Part Number: R0402_22R_1%_0.0625W_100PPM; Component Kind: Standard; Component Type: Standard; Pin Count: 2; Value: 22; Status: Not Recommended; Power: 0.0625W; Tolerance: ±1%; Manufacturer Part Number: R0402_22R_1%_0.0625W_100PPM; Case: 0402; Mounted: Yes; Sense: No; Socket: No; SMD: Yes; Manufacturer1 Example: YAGEO PHYCOMP; Manufacturer1 ComponentHeight: 0.4mm; HelpURL: \\cern.ch\dfs\Applications\Altium\Datasheets\R0402_Phycomp_RC0402.pdf; Author: CERN DEM JLC; CreateDate: 03/12/2007; LatestRevisionDate: 17/10/2012
SW1-SW3 = SW_TYCO_1571983-4: 4 Ways SPST DIP Switch; Part Description: 4 Way SPST SMD DIP Switch, Latched, Contact Rating 0.025A 24VDC; Manufacturer: TYCO; Manufacturer Part Number: 1571983-4 or GDH04S04; PressFit: No; Part Number: SW_TYCO_1571983-4; Component Kind: Standard; Component Type: Standard; Pin Count: 8; PackageDescription: Pitch 1.27mm,  Body 6.2x6.2mm, 4 Ways SPST Surface-Mount DIP Switch, TYCO GDH Series; Family: Switch; Mounted: Yes; Socket: No; SMD: Yes; Sense: No; Status: None; ComponentHeight: 2.31mm; HelpURL: \\cern.ch\dfs\Applications\Altium\Datasheets\SW_TYCO_1571983-4.pdf; Author: CERN DEM JLC; CreateDate: 08/01/2009; LatestRevisionDate: 08/01/2009
U1 = CMP-0962-00001-1: as U1 on sheet FPGA_LVDS; PackageReference: caBGA-256; PackageDescription: 256-Ball Chip Array Ball Grid Array, Body 14 x 14 mm, Pitch 0.8 mm; RoHS: TRUE; Packing: Tray; Mounting Technology: Surface Mount; ComponentLink3URL: http://www.latticesemi.com/lit/docs/package/pkg.pdf; ComponentLink1Description: Manufacturer URL; ComponentLink3Description: Package Specification; Code_JEDEC: MO-275; PackageVersion: Rev. 03.9, 02/2013; ComponentLink1URL: http://www.latticesemi.com/en; ComponentLink2URL: http://www.latticesemi.com/~/media/Documents/DataSheets/iCE/iCE40LPHXFamilyDataSheet.pdf; PartNumber: ICE40HX8K-CT256; ComponentLink2Description: Datasheet; DatasheetVersion: Rev. 02.9

## Sheet I2C_switch.SchDoc: Humpback
size 420 x 297 mm; EDA_Number: ARTIQ; Projet: Humpback; Author: G.Kasprowicz; CompanyName: WUT ISE; DrawnBy: G.Kasprowicz; Organization: WUT ISE; Address1: PW ISE; Address2: Nowowiejska 15/19 00-665 Warsaw; Address3: gkasprow@gmail.com; DocumentNumber: 6; Revision: 1.0; SheetNumber: 6; SheetTotal: 11; ModifiedBy: -; CheckedDate: -; Title2: I2C switch v1.0; DivGrp: WUT ISE; Designer: G.Kasprowicz; ModifiedDate: -; ProjectName: Sensor Box
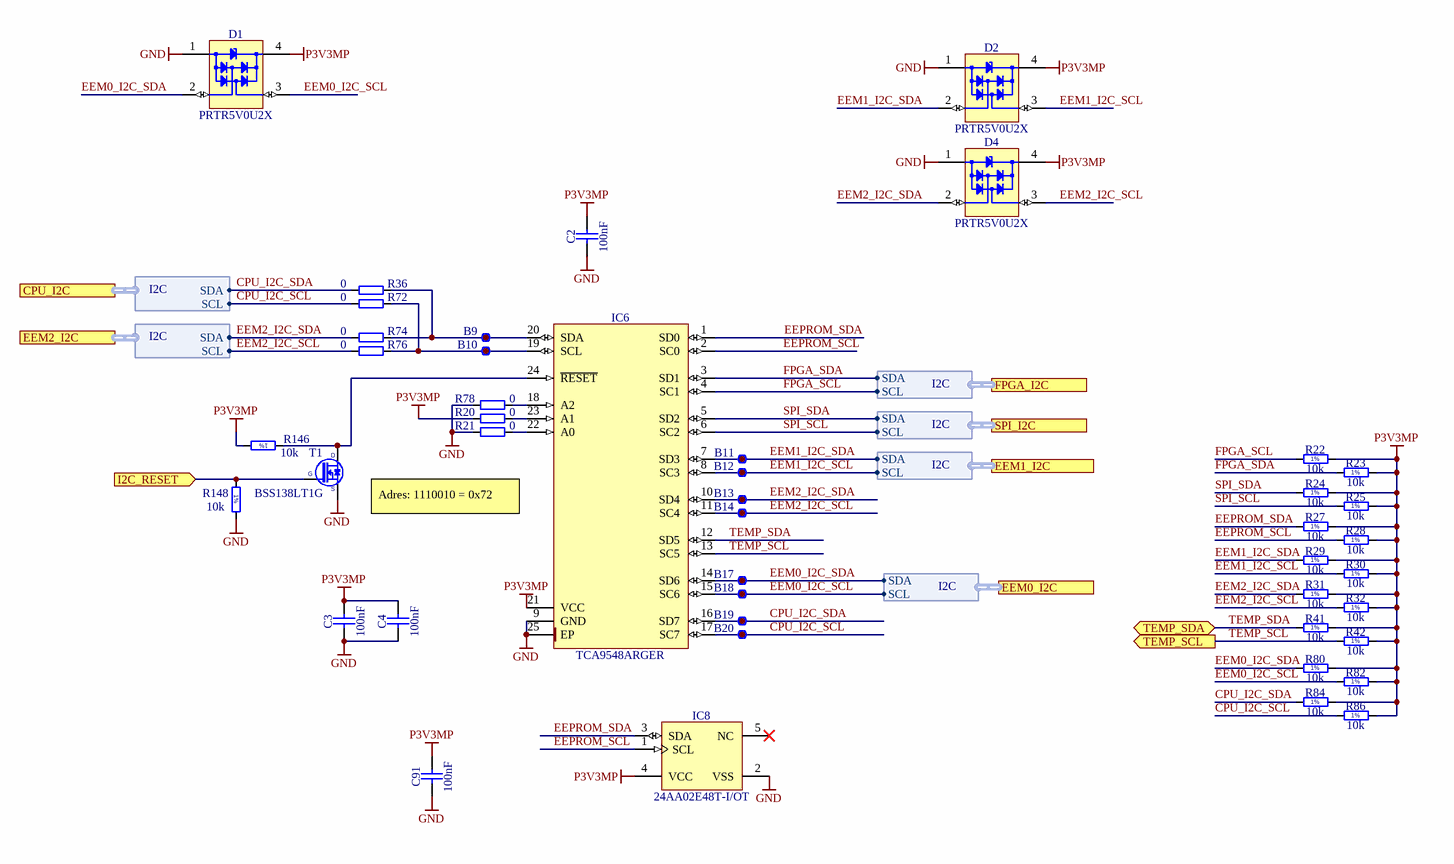
[diagram p3: I2C_switch.SchDoc]

### Parts
B9  SMD Pad  [C100]  (value not drawn)
B10  SMD Pad  [C100]  (value not drawn)
B11  SMD Pad  [C100]  (value not drawn)
B12  SMD Pad  [C100]  (value not drawn)
B13  SMD Pad  [C100]  (value not drawn)
B14  SMD Pad  [C100]  (value not drawn)
B17  SMD Pad  [C100]  (value not drawn)
B18  SMD Pad  [C100]  (value not drawn)
B19  SMD Pad  [C100]  (value not drawn)
B20  SMD Pad  [C100]  (value not drawn)
C2  100nF  [CAPC1005X55N]
C3  100nF  [CAPC1005X55N]
C4  100nF  [CAPC1005X55N]
C91  100nF  [CAPC1005X55N]
D1  PRTR5V0U2X  [SOT190P230X110-4N]
D2  PRTR5V0U2X  [SOT190P230X110-4N]
D4  PRTR5V0U2X  [SOT190P230X110-4N]
IC6  TCA9548ARGER  [QFN50P400X400X100-25N-S220]
IC8  24AA02E48T-I/OT  [SOT95P280X145-5N]
R20  0  [RESC1005X40N]
R21  0  [RESC1005X40N]
R22  10k  [RESC1005X40N]
R23  10k  [RESC1005X40N]
R24  10k  [RESC1005X40N]
R25  10k  [RESC1005X40N]
R27  10k  [RESC1005X40N]
R28  10k  [RESC1005X40N]
R29  10k  [RESC1005X40N]
R30  10k  [RESC1005X40N]
R31  10k  [RESC1005X40N]
R32  10k  [RESC1005X40N]
R36  0  [RESC1608X55N]
R41  10k  [RESC1005X40N]
R42  10k  [RESC1005X40N]
R72  0  [RESC1608X55N]
R74  0  [RESC1608X55N]
R76  0  [RESC1608X55N]
R78  0  [RESC1005X40N]
R80  10k  [RESC1005X40N]
R82  10k  [RESC1005X40N]
R84  10k  [RESC1005X40N]
R86  10k  [RESC1005X40N]
R146  10k  [RESC1005X40N]
R148  10k  [RESC1005X40N]
T1  BSS138LT1G  [SOT95P240X110-3N]

### Ports
CPU_I2C (harness I2C), EEM0_I2C (harness I2C), EEM1_I2C (harness I2C), EEM2_I2C (harness I2C), FPGA_I2C (harness I2C), I2C_RESET (in), SPI_I2C (harness I2C), TEMP_SCL (out), TEMP_SDA (bidir)

### Harnesses
I2C: SDA, SCL

### Nets
GND: C2.1 C3.1 C4.1 C91.1 D1.1(GND) D2.1(GND) D4.1(GND) IC6.9(GND) IC6.25(EP) IC8.2(VSS) R21.1 R78.1 R148.2 T1.2(S)
P3V3MP: C2.2 C3.2 C4.2 C91.2 D1.4(VCC) D2.4(VCC) D4.4(VCC) IC6.21(VCC) IC8.4(VCC) R20.1 R22.2 R23.2 R24.2 R25.2 R27.2 R28.2 R29.2 R30.2 R31.2 R32.2 R41.2 R42.2 R80.2 R82.2 R84.2 R86.2 R146.2
CPU_I2C_SCL: B20.1 IC6.17(SC7) R72.1 R86.1 ; port CPU_I2C.SCL  [project net SCL]
CPU_I2C_SDA: B19.1 IC6.16(SD7) R36.1 R84.1 ; port CPU_I2C.SDA  [project net SDA]
EEM0_I2C_SCL: B18.1 D1.3(I/O2) IC6.15(SC6) R82.1 ; port EEM0_I2C.SCL
EEM0_I2C_SDA: B17.1 D1.2(I/O1) IC6.14(SD6) R80.1 ; port EEM0_I2C.SDA
EEM1_I2C_SCL: B12.1 D2.3(I/O2) IC6.8(SC3) R30.1 ; port EEM1_I2C.SCL
EEM1_I2C_SDA: B11.1 D2.2(I/O1) IC6.7(SD3) R29.1 ; port EEM1_I2C.SDA
EEM2_I2C_SCL: B14.1 D4.3(I/O2) IC6.11(SC4) R32.1 R76.1 ; port EEM2_I2C.SCL
EEM2_I2C_SDA: B13.1 D4.2(I/O1) IC6.10(SD4) R31.1 R74.1 ; port EEM2_I2C.SDA
EEPROM_SCL: IC6.2(SC0) IC8.1(SCL) R28.1
EEPROM_SDA: IC6.1(SD0) IC8.3(SDA) R27.1
FPGA_SCL: IC6.4(SC1) R22.1 ; port FPGA_I2C.SCL
FPGA_SDA: IC6.3(SD1) R23.1 ; port FPGA_I2C.SDA
I2C_RESET: R148.1 T1.1(G) ; port I2C_RESET
SPI_SCL: IC6.6(SC2) R25.1 ; port SPI_I2C.SCL
SPI_SDA: IC6.5(SD2) R24.1 ; port SPI_I2C.SDA
TEMP_SCL: IC6.13(SC5) R42.1 ; port TEMP_SCL
TEMP_SDA: IC6.12(SD5) R41.1 ; port TEMP_SDA
NetB9_1: B9.1 IC6.20(SDA) R36.2 R74.2
NetB10_1: B10.1 IC6.19(SCL) R72.2 R76.2
NetIC6_18: IC6.18(A2) R78.2
NetIC6_22: IC6.22(A0) R21.2
NetIC6_23: IC6.23(A1) R20.2
NetIC6_24: IC6.24(~{RESET}) R146.1 T1.3(D)

Not connected (* = marked no-connect by the designer): IC8 5(NC)*

### Notes on the sheet
- Adres: 1110010 = 0x72
- Project/Equipment
- Document
- Designer
- Drawn by
- Check.by
- Copyright WUT ISE 2018.
  This documentation describes Open Hardware and is licensed under the CERN OHL v.1.1. You may redistribute and modify this documentation under the terms of the CERN OHL v.1.1. (http://ohwr.org/CERNOHL). This documentation is distributed WITHOUT ANY EXPRESS OR IMPLIED WARRANTY, INCLUDING OF MERCHANTABILITY, SATISFACTORY QUALITY AND FITNESS FOR A PARTICULAR PURPOSE. Please see the CERN OHL v.1.1 for applicable conditions.
- Contact
- File
- Last Mod.
- Print Date
- Sheet
- Size
- A3
- of
- Rev
- (in symbol R0402_10K_1%_0.0625W_100PPM) 1%

### Library data of the parts
B9-B14 B17-B20 = SMD_PAD_D1MM: Through Hole Pad; Part Description: 1mm Diameter SMD Pad; Mounted: No; Part Number: SMD_PAD_D1MM; Component Kind: Standard (No BOM); Component Type: Standard (No BOM); Pin Count: 1; Family: SMD Pad; Socket: No; SMD: No; Sense: No; Status: None; ComponentHeight: 0mm; HelpURL: Undefined; Author: CERN DEM JLC; CreateDate: 10.10.2017; LatestRevisionDate: 10.10.2017; PackageDescription: 1mm Diameter SMD Pad
C2-C4 C91 = CC0402_100NF_16V_10%_X5R: as C85 on sheet FPGA; Part Number: CC0402_100NF_16V_10%_X5R; Component Kind: Standard; Component Type: Standard; Pin Count: 2; Value: 100nF; Status: None; Manufacturer Part Number: CC0402_100NF_16V_10%_X5R; Case: 0402; Mounted: Yes; Socket: No; SMD: Yes; Sense: No; Manufacturer1 Example: MURATA; Manufacturer1 ComponentHeight: 0.55mm; HelpURL: \\cern.ch\dfs\Applications\Altium\Datasheets\CC0402_X5R_MURATA_GRM.pdf; Author: CERN DEM JLC; CreateDate: 10/12/2013; LatestRevisionDate: 10/12/2013
D1 D2 D4 = PRTR5V0U2X: Ultra Low Capacitance Double Rail-to-Rail ESD Protection Diode; Part Description: Ultra Low Capacitance (1pF) Double Rail-to-Rail ESD Protection Diode (8kV); Manufacturer: NXP SEMICONDUCTORS; Voltage: 5.5V; PressFit: No; Bonding: No; Part Number: PRTR5V0U2X; Component Kind: Standard; Component Type: Standard; Device: PRTR5V0U2X; PackageDescription: SOT143B, SOT, 1.90mm Pitch; 4 Pin, 1.30mm W X 2.90mm L X 1.10mm H body, IPC Medium Density; Manufacturer Part Number: PRTR5V0U2X; Pin Count: 4; Case: SOT143B; Mounted: Yes; Socket: No; SMD: Yes; Sense: No; ComponentHeight: 1.1mm; HelpURL: \\cern.ch\dfs\Applications\Altium\Datasheets\PRTR5V0U2X.pdf; Author: CERN DEM JLC; CreateDate: 22.03.2011; LatestRevisionDate: 22.03.2011
IC6 = TCA9548ARGER: Low Voltage 8-Channel I2C Switch With Reset; Manufacturer: TEXAS INSTRUMENTS; PressFit: No; Bonding: No; Part Number: TCA9548ARGER; Component Kind: Standard; Component Type: Standard; Device: TCA9548ARGER; PackageDescription: QFN, 0.50mm Pitch, Square; 24 Pin, 4.00mm L X 4.00mm W X 1.00mm H body (w/thermal tab 2.2 X 2.2mm), IPC Medium Density; Part Description: Low Voltage 8-Channel I2C Switch With Reset; Manufacturer Part Number: TCA9548ARGER; Pin Count: 25; Case: QFN24; Mounted: Yes; Socket: No; SMD: Yes; Sense: No; ComponentHeight: 1mm; Author: CERN DEM JLC; HelpURL: \\cern.ch\dfs\Applications\Altium\Datasheets\TCA9548ARGER.pdf; CreateDate: 07.07.2014; LatestRevisionDate: 07.07.2014
IC8 = 24AA02E48T-I/OT: 1.7V-5.5V, 2K I2C Serial EEPROM With EUI-48 Node Identity; Manufacturer: MICROCHIP TECHNOLOGY; PressFit: No; Bonding: No; Part Number: 24AA02E48T-I/OT; Component Kind: Standard; Component Type: Standard; Device: 24AA02E48T-I/OT; PackageDescription: SOT, 0.95mm pitch; 5 pin, 1.60mm W X 2.90mm L X 1.45mm H body, IPC Medium Density; Part Description: 1.7V-5.5V, 2K I2C Serial EEPROM With EUI-48 Node Identity; Manufacturer Part Number: 24AA02E48T-I/OT; Pin Count: 5; Case: SOT23-5; Mounted: Yes; Socket: No; SMD: Yes; Sense: No; ComponentHeight: 1.45mm; HelpURL: \\cern.ch\dfs\Applications\Altium\Datasheets\24AA02E48T-I-OT.pdf; Author: CERN DEM MR; CreateDate: 2016-03-31; LatestRevisionDate: 2016-03-31
R20 R21 R78 = R0402_0R_JUMPER: Resistor; Part Description: 1A (0.05R Max DC Resistance) Zero Ohm Jumper; Manufacturer: GENERIC; Manufacturer1 Part Number: 232270591001L; PressFit: No; Part Number: R0402_0R_JUMPER; Component Kind: Standard; Component Type: Standard; Pin Count: 2; Value: 0; Status: Not Recommended; Manufacturer Part Number: R0402_0R_JUMPER; Case: 0402; Mounted: Yes; Sense: No; Socket: No; SMD: Yes; Manufacturer1 Example: YAGEO PHYCOMP; Manufacturer1 ComponentHeight: 0.4mm; HelpURL: \\cern.ch\dfs\Applications\Altium\Datasheets\R0402_Phycomp_RC0402.pdf; Author: CERN DEM JLC; CreateDate: 03.12.2007; LatestRevisionDate: 17.10.2012
R22-R25 R27-R32 R41 R42 R80 R82 R84 R86 = R0402_10K_1%_0.0625W_100PPM: Resistor - 1%; Part Description: General Purpose Thick Film Chip Resistor; Manufacturer: GENERIC; Manufacturer1 Part Number: 232270671003L; TC: ±100ppm/°C; PressFit: No; Part Number: R0402_10K_1%_0.0625W_100PPM; Component Kind: Standard; Component Type: Standard; Pin Count: 2; Value: 10k; Status: Not Recommended; Power: 0.0625W; Tolerance: ±1%; Manufacturer Part Number: R0402_10K_1%_0.0625W_100PPM; Case: 0402; Mounted: Yes; Sense: No; Socket: No; SMD: Yes; Manufacturer1 Example: YAGEO PHYCOMP; Manufacturer1 ComponentHeight: 0.4mm; HelpURL: \\cern.ch\dfs\Applications\Altium\Datasheets\R0402_Phycomp_RC0402.pdf; Author: CERN DEM JLC; CreateDate: 03.12.2007; LatestRevisionDate: 17.10.2012
R36 R72 R74 R76 = R0603_0R_JUMPER: Resistor; Part Description: 1A (0.05R Max DC Resistance) Zero Ohm Jumper; Manufacturer: GENERIC; Manufacturer1 Part Number: NRC06Z0; PressFit: No; Part Number: R0603_0R_JUMPER; Component Kind: Standard; Component Type: Standard; Pin Count: 2; Value: 0; Status: Preferred; Manufacturer Part Number: R0603_0R_JUMPER; Case: 0603; Mounted: Yes; Sense: No; Socket: No; SMD: Yes; Manufacturer1 Example: NIC COMPONENT; Manufacturer1 ComponentHeight: 0.55mm; HelpURL: \\cern.ch\dfs\Applications\Altium\Datasheets\R0603_NIC_NRC.pdf; Author: CERN DEM JLC; CreateDate: 03/12/2007; LatestRevisionDate: 13/03/2008
R146 R148 = R0402_10K_1%_0.0625W_100PPM: Resistor - 1%; Part Description: General Purpose Thick Film Chip Resistor; Manufacturer: GENERIC; Manufacturer1 Part Number: 232270671003L; TC: ±100ppm/°C; Table: Resistors SMD; Part Number: R0402_10K_1%_0.0625W_100PPM; Component Kind: Standard; Component Type: Standard; Pin Count: 2; Value: 10k; Status: Not recommended; Power: 0.0625W; Tolerance: ±1%; Manufacturer Part Number: R0402_10K_1%_0.0625W_100PPM; Case: 0402; Mounted: Yes; Socket: No; SMD: Yes; Manufacturer1 Example: YAGEO PHYCOMP; Manufacturer1 ComponentHeight: 0.4mm; HelpURL: \\cern.ch\dfs\Applications\Altium\Datasheets\R0402_Phycomp_RC0402.pdf; Author: CERN DEM JLC; CreateDate: 2007-12-03; LatestRevisionDate: 2012-10-17
T1 = BSS138LT1G: N-CHANNEL MOSFET WITH DIODE; Part Description: 50V 200mA N-Channel Enhancement Mode Field-Effect Transistor; Manufacturer: ON SEMICONDUCTOR; PressFit: No; Bonding: No; Part Number: BSS138LT1G; Component Kind: Standard; Component Type: Standard; Device: BSS138LT1G; PackageDescription: SOT23 3-Leads, Pitch 0.95mm - Body 1.4x3mm, IPC Medium Density; Manufacturer Part Number: BSS138LT1G; Pin Count: 3; Case: SOT23-3; Mounted: Yes; Socket: No; SMD: Yes; Sense: No; ComponentHeight: 1.11mm; HelpURL: \\cern.ch\dfs\Applications\Altium\Datasheets\BSS138LT1G.pdf; Author: CERN DEM JLC; CreateDate: 23/03/2009; LatestRevisionDate: 23/03/2009